# EasyEDA Pro project ProProject_circuller_2023-11-15.epro

# Schematic Schematic1
Create Date: 2023-10-07; Page Name: P1; Project Name: circuller; Schematic Name: Schematic1; Update Date: 2023-10-11; Company: MPAM Lab; Page Size: A3; Version: 0.1
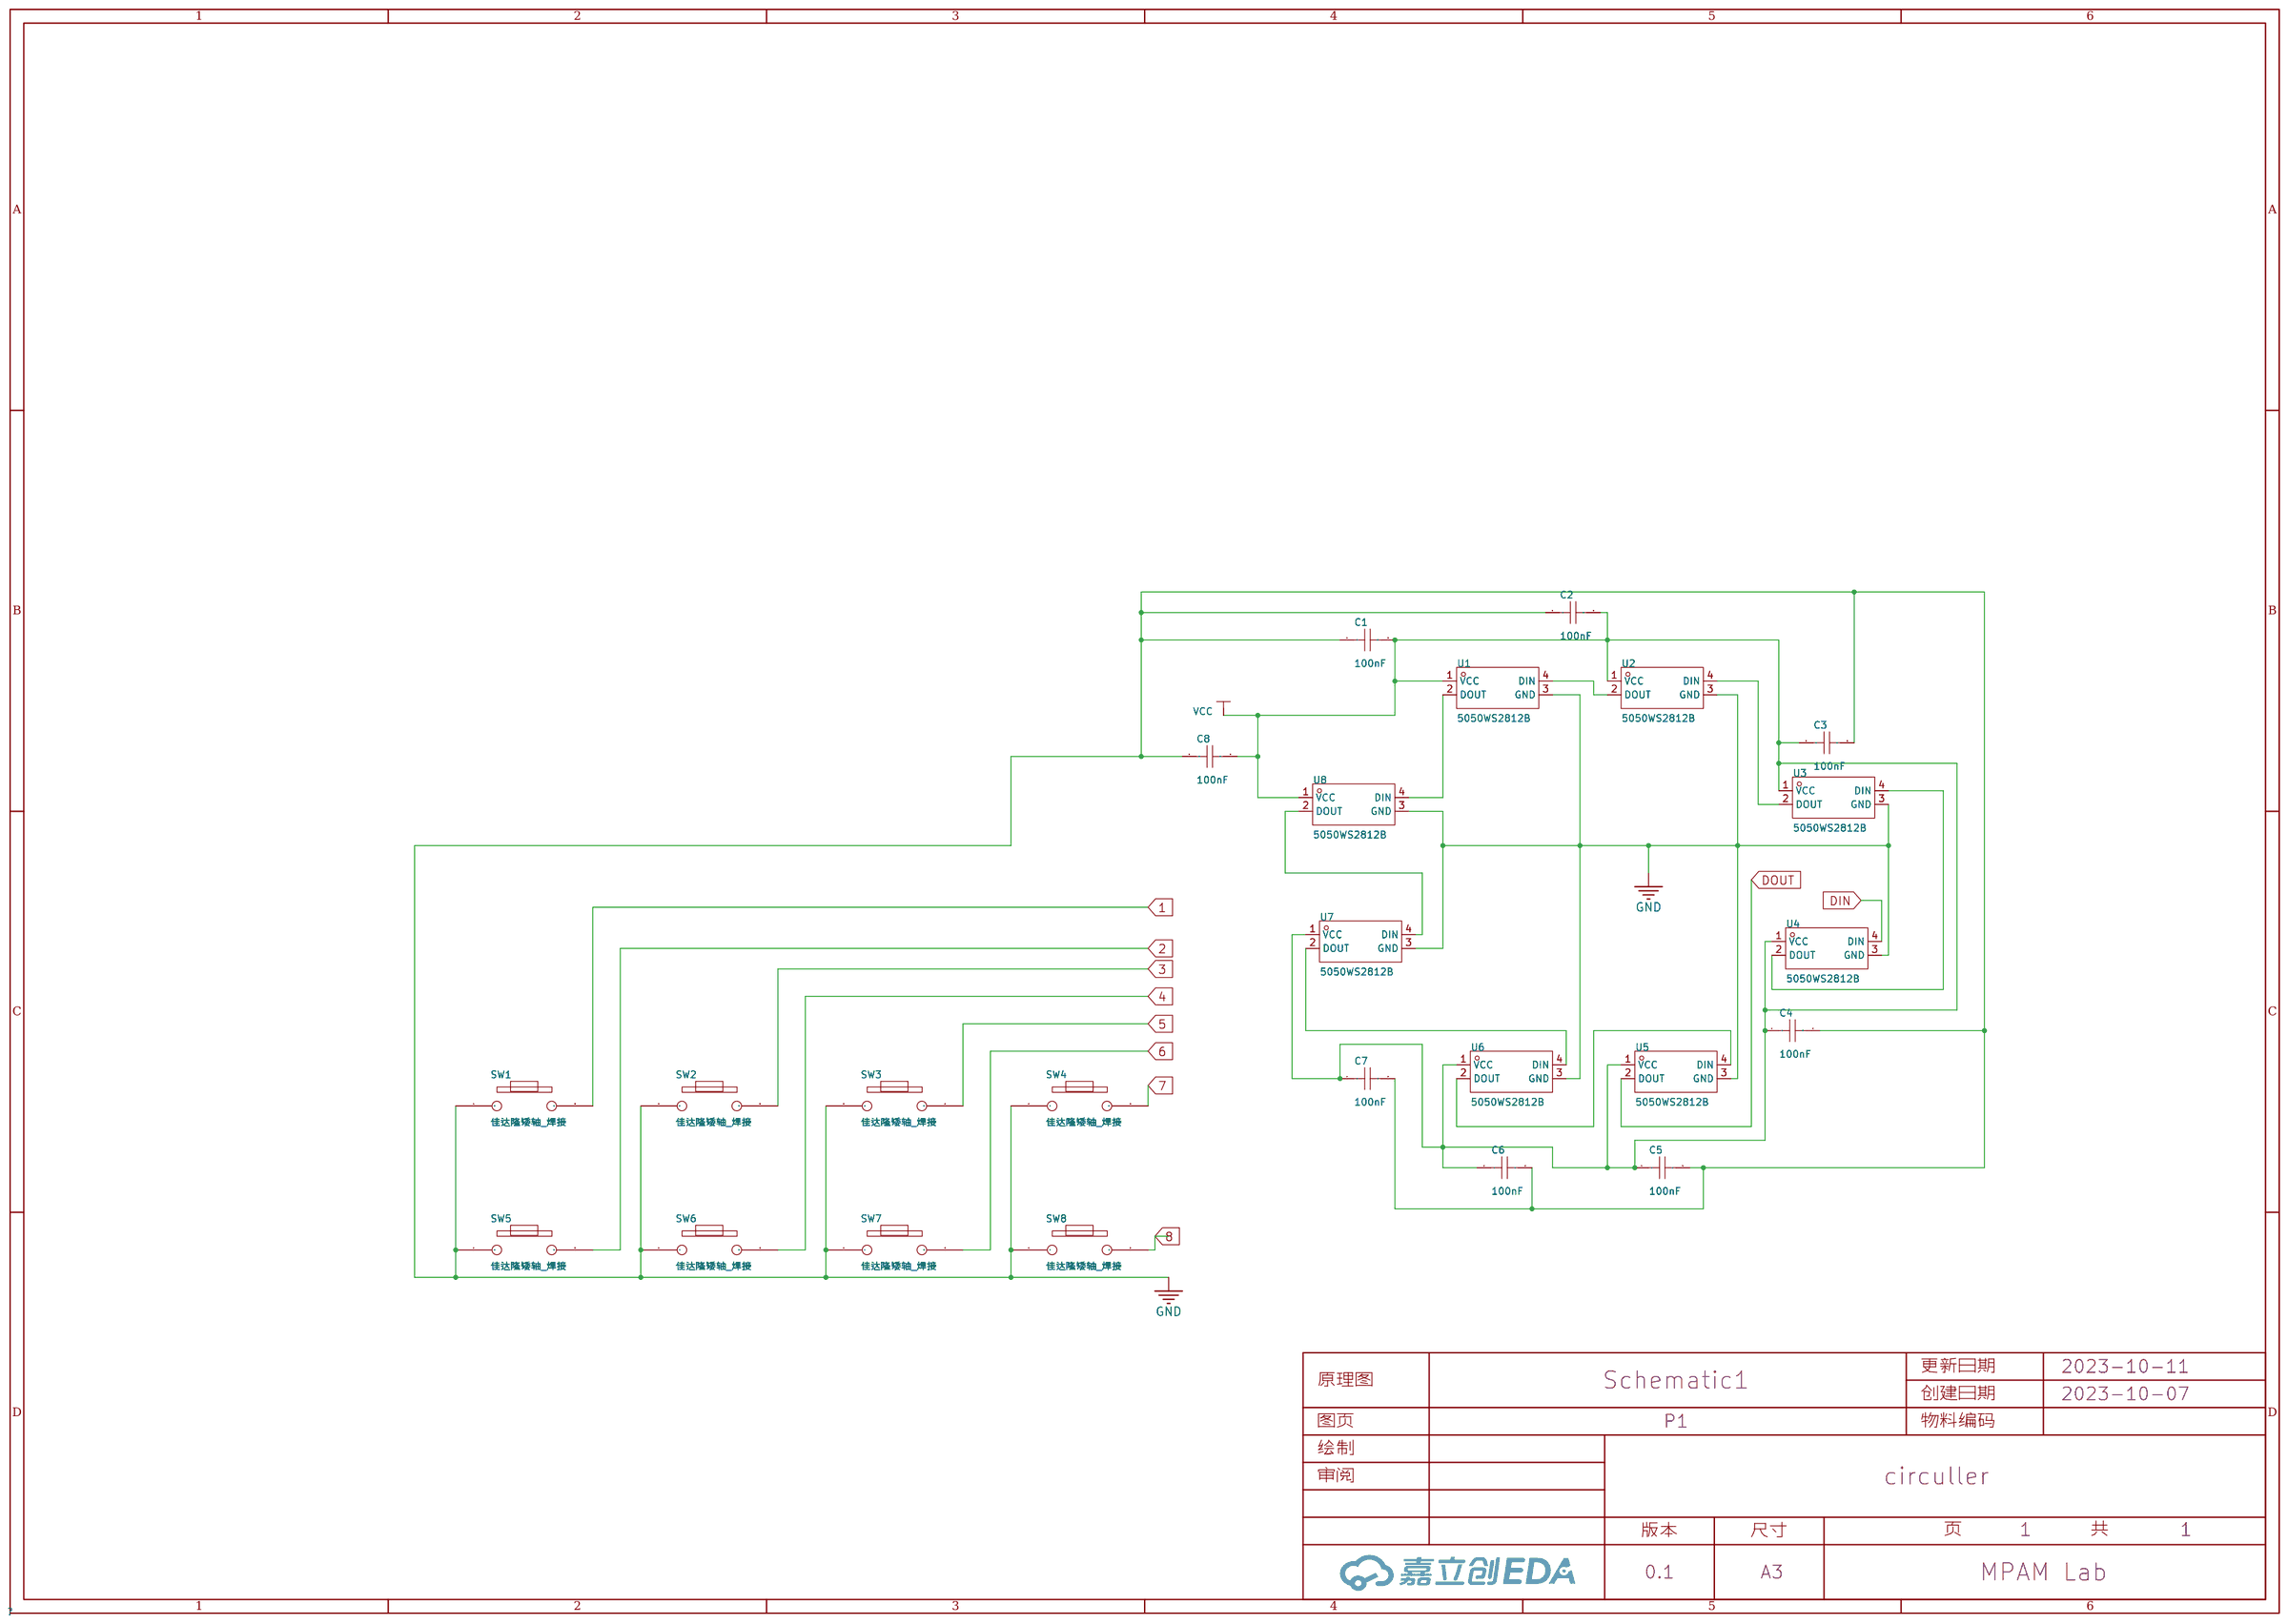
[diagram p0: schematic sheet]

## Parts
C1  100nF  [C0603]
C2  100nF  [C0603]
C3  100nF  [C0603]
C4  100nF  [C0603]
C5  100nF  [C0603]
C6  100nF  [C0603]
C7  100nF  [C0603]
C8  100nF  [C0603]
SW1  佳达隆矮轴_焊接  [佳达隆矮轴焊接]
SW2  佳达隆矮轴_焊接  [佳达隆矮轴焊接]
SW3  佳达隆矮轴_焊接  [佳达隆矮轴焊接]
SW4  佳达隆矮轴_焊接  [佳达隆矮轴焊接]
SW5  佳达隆矮轴_焊接  [佳达隆矮轴焊接]
SW6  佳达隆矮轴_焊接  [佳达隆矮轴焊接]
SW7  佳达隆矮轴_焊接  [佳达隆矮轴焊接]
SW8  佳达隆矮轴_焊接  [佳达隆矮轴焊接]
U1  5050WS2812B  [LED-SMD_5050WS2812B]
U2  5050WS2812B  [LED-SMD_5050WS2812B]
U3  5050WS2812B  [LED-SMD_5050WS2812B]
U4  5050WS2812B  [LED-SMD_5050WS2812B]
U5  5050WS2812B  [LED-SMD_5050WS2812B]
U6  5050WS2812B  [LED-SMD_5050WS2812B]
U7  5050WS2812B  [LED-SMD_5050WS2812B]
U8  5050WS2812B  [LED-SMD_5050WS2812B]

## Library data of the parts
C1-C8 = CAP_0603: Supplier Footprint: 0603
SW1-SW8 = 佳达隆矮轴_焊接: Supplier: eyy
U1-U8 = 5050WS2812B: Supplier Part: C2874876; Supplier Footprint: LED-SMD-4_L5.0-W5.0-P3.20-LS5.4; JLCPCB Part Class: 扩展库; Datasheet: 2021-08-01/763763S/fc73e402754744b5b9326c8825dec5cc/ws2812B.pdf; Supplier: LCSC

## Nets
GND: C1.1 C2.1 C3.2 C4.2 C5.2 C6.2 C7.2 C8.1 SW1.1 SW2.1 SW3.1 SW4.1 SW5.1 SW6.1 SW7.1 SW8.1 U1.3(GND) U2.3(GND) U3.3(GND) U4.3(GND) U5.3(GND) U6.3(GND) U7.3(GND) U8.3(GND)
VCC: C1.2 C2.2 C3.1 C4.1 C5.1 C6.1 C7.1 C8.2 U1.1(VCC) U2.1(VCC) U3.1(VCC) U4.1(VCC) U5.1(VCC) U6.1(VCC) U7.1(VCC) U8.1(VCC)
1: SW1.2
2: SW5.2
3: SW2.2
4: SW6.2
5: SW3.2
6: SW7.2
7: SW4.2
8: SW8.2
DIN: U4.4(DIN)
DOUT: U5.2(DOUT)
$1N1699: U1.2(DOUT) U8.4(DIN)
$1N1729: U1.4(DIN) U2.2(DOUT)
$1N1734: U2.4(DIN) U3.2(DOUT)
$1N1800: U3.4(DIN) U4.2(DOUT)
$1N1842: U6.4(DIN) U7.2(DOUT)
$1N1852: U5.4(DIN) U6.2(DOUT)
$1N6884: U7.4(DIN) U8.2(DOUT)

# Schematic Ver 2
Create Date: 2023-11-13; Page Name: P1; Project Name: circuller; Schematic Name: Ver 2; Update Date: 2023-11-15; Company: MPAM Laboratory; Drawed: FDS; Page Size: A4; Part Number: M-CIR-PCB-1; Reviewed: FDS; Version: V1.0
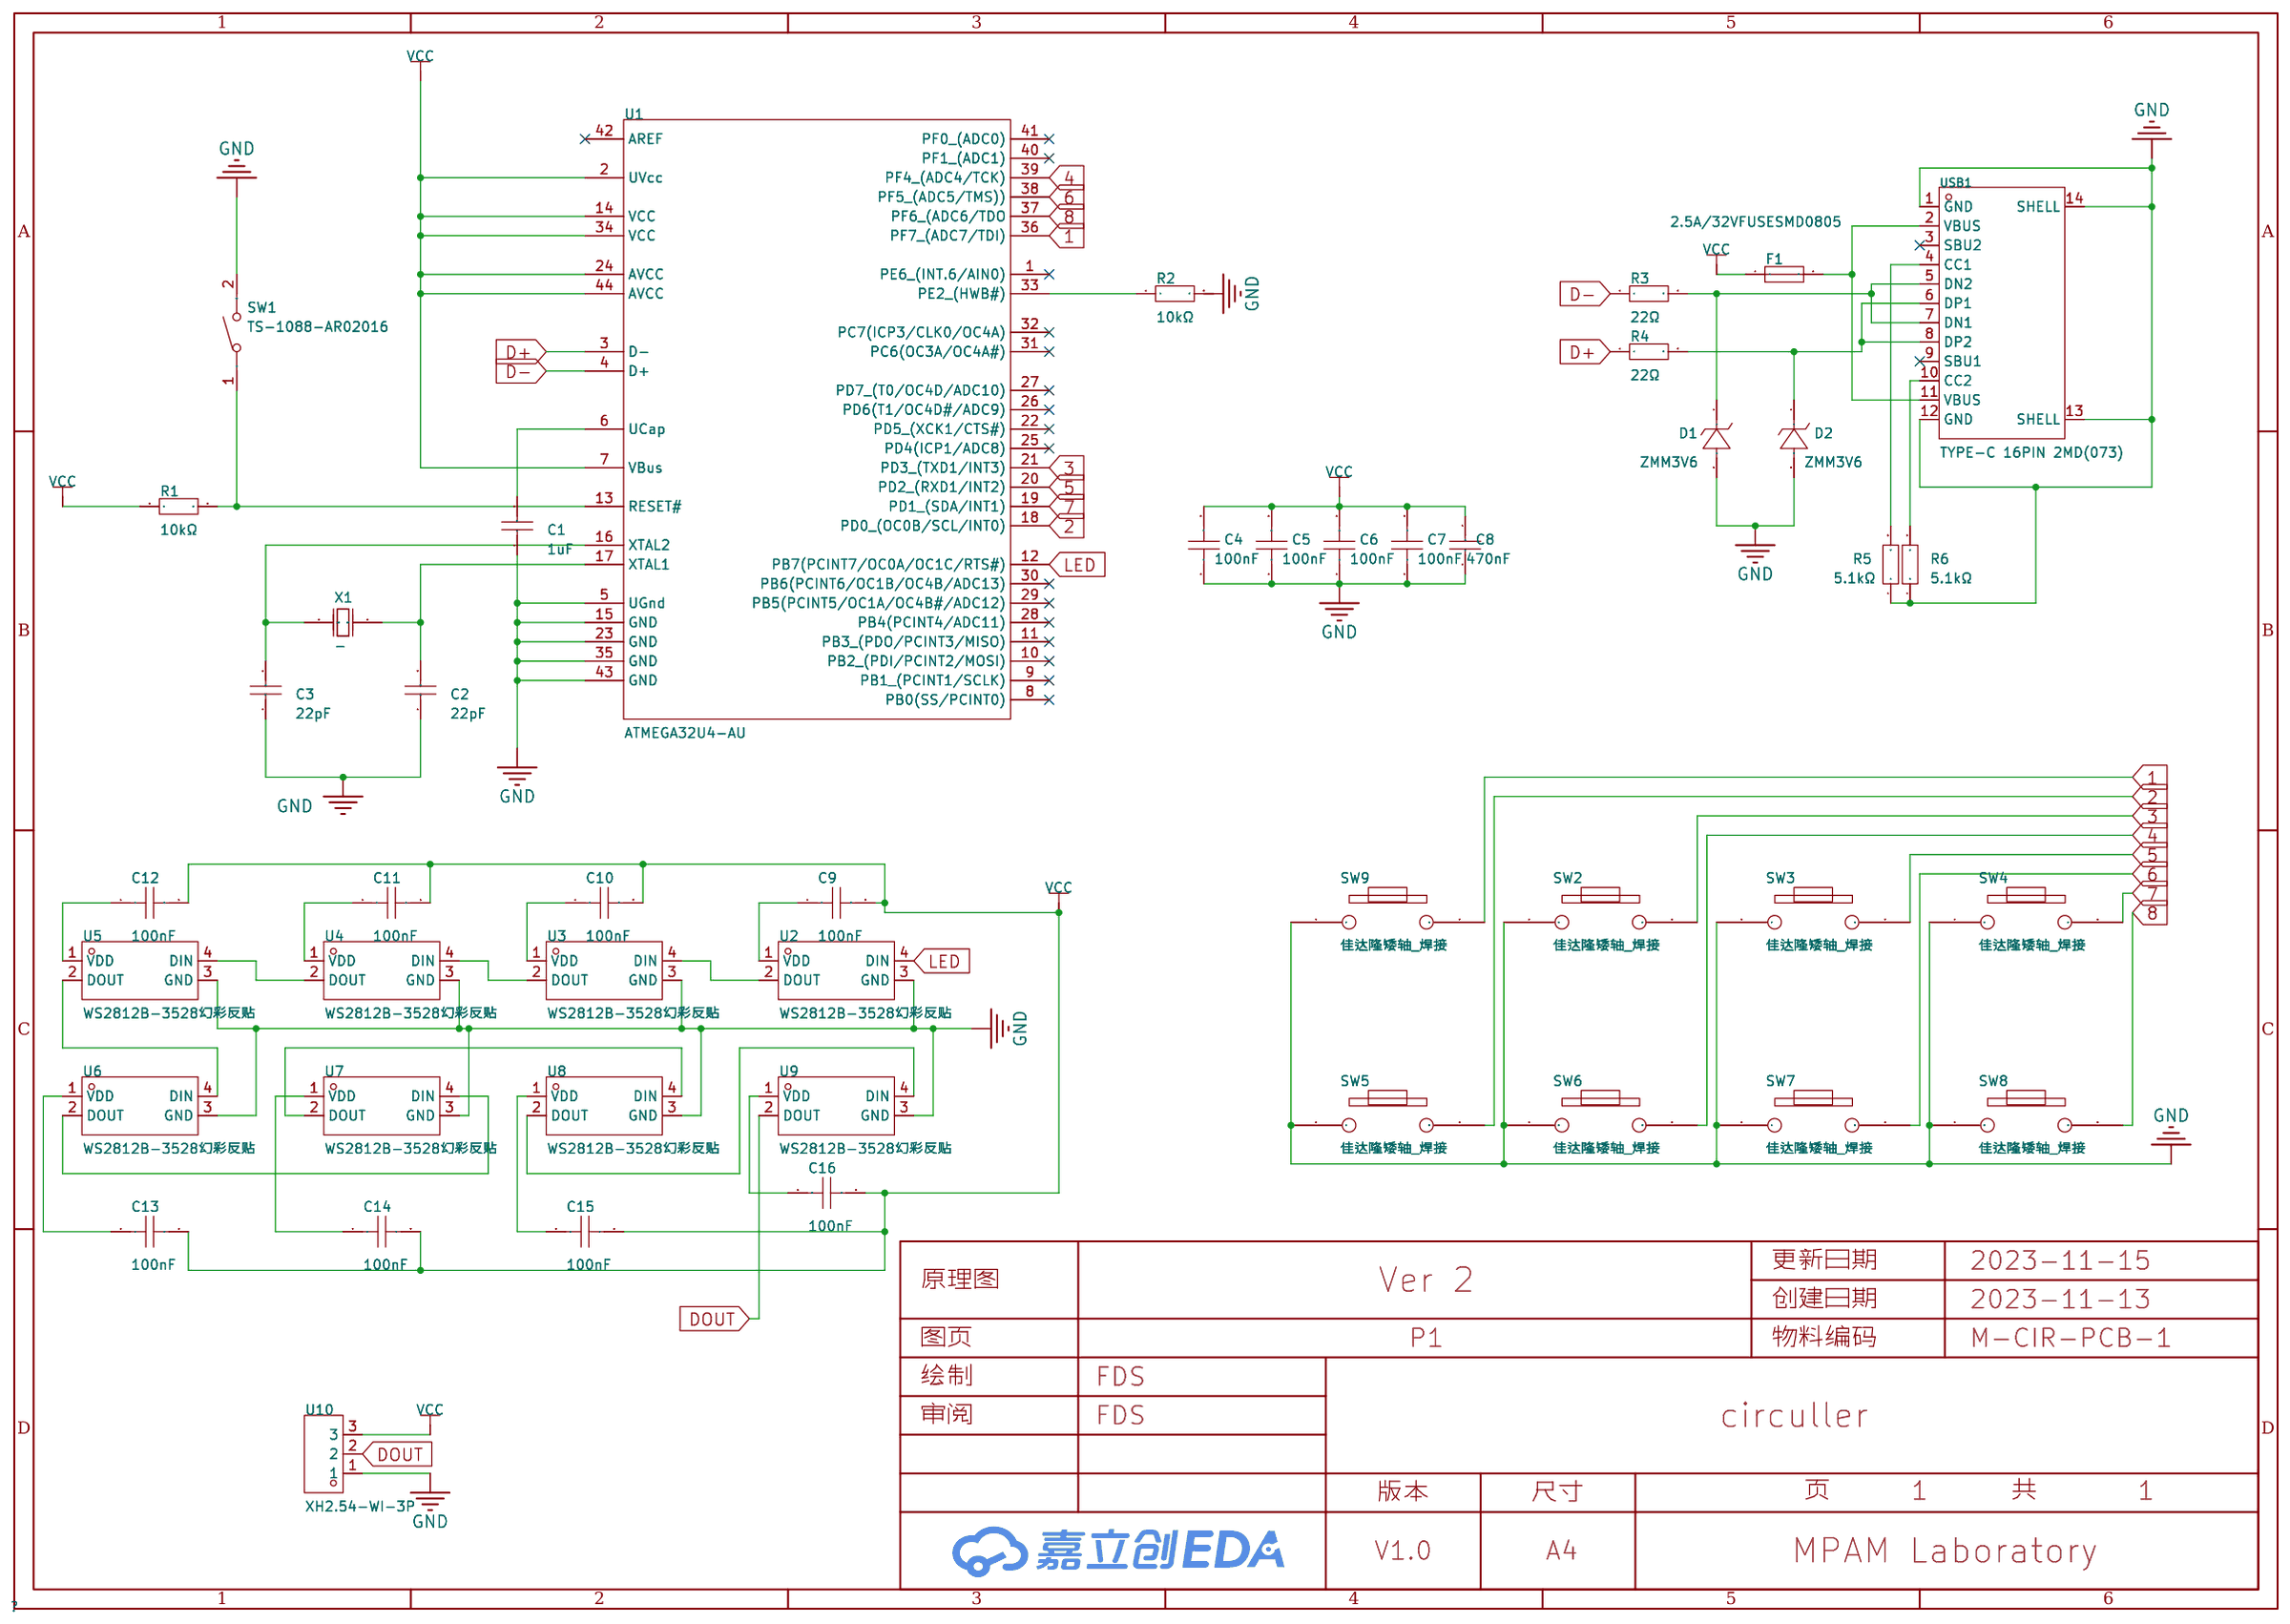
[diagram p1: schematic sheet]

## Parts
C1  1uF  [C0603]
C2  22pF  [C0603]
C3  22pF  [C0603]
C4  100nF  [C0603]
C5  100nF  [C0603]
C6  100nF  [C0603]
C7  100nF  [C0603]
C8  470nF  [C0603]
C9  100nF  [C0603]
C10  100nF  [C0603]
C11  100nF  [C0603]
C12  100nF  [C0603]
C13  100nF  [C0603]
C14  100nF  [C0603]
C15  100nF  [C0603]
C16  100nF  [C0603]
D1  ZMM3V6  [LL-34_L3.5-W1.5-RD]
D2  ZMM3V6  [LL-34_L3.5-W1.5-RD]
F1  2.5A/32VFUSESMD0805  [F0805]
R1  10kΩ  [R0603]
R2  10kΩ  [R0603]
R3  22Ω  [R0603]
R4  22Ω  [R0603]
R5  5.1kΩ  [R0603]
R6  5.1kΩ  [R0603]
SW1  TS-1088-AR02016  [SW-SMD_L3.9-W3.0-P4.45]
SW2  佳达隆矮轴_焊接  [佳达隆矮轴焊接]
SW3  佳达隆矮轴_焊接  [佳达隆矮轴焊接]
SW4  佳达隆矮轴_焊接  [佳达隆矮轴焊接]
SW5  佳达隆矮轴_焊接  [佳达隆矮轴焊接]
SW6  佳达隆矮轴_焊接  [佳达隆矮轴焊接]
SW7  佳达隆矮轴_焊接  [佳达隆矮轴焊接]
SW8  佳达隆矮轴_焊接  [佳达隆矮轴焊接]
SW9  佳达隆矮轴_焊接  [佳达隆矮轴焊接]
U1  ATMEGA32U4-AU  [QFP-44_L10.0-W10.0-P0.80-LS13.2-BL]
U2  WS2812B-3528幻彩反贴  [LED-SMD_L3.2-W2.8-TR]
U3  WS2812B-3528幻彩反贴  [LED-SMD_L3.2-W2.8-TR]
U4  WS2812B-3528幻彩反贴  [LED-SMD_L3.2-W2.8-TR]
U5  WS2812B-3528幻彩反贴  [LED-SMD_L3.2-W2.8-TR]
U6  WS2812B-3528幻彩反贴  [LED-SMD_L3.2-W2.8-TR]
U7  WS2812B-3528幻彩反贴  [LED-SMD_L3.2-W2.8-TR]
U8  WS2812B-3528幻彩反贴  [LED-SMD_L3.2-W2.8-TR]
U9  WS2812B-3528幻彩反贴  [LED-SMD_L3.2-W2.8-TR]
U10  XH2.54-WI-3P  [CONN-TH_XH2.54-WI-3P]
USB1  TYPE-C 16PIN 2MD(073)  [USB-C-SMD_TYPE-C-6PIN-2MD-073]
X1  -  [OSC-SMD_2P-L5.0-W3.2]

## Library data of the parts
C1 = CL10A105KB8NNNC: 容值:1uF;精度:±10%;额定电压:50V;材质(温度系数):X5R;; LCSC Part Name: 1uF ±10% 50V; Supplier Part: C15849; Manufacturer: SAMSUNG(三星); Supplier Footprint: 0603; JLCPCB Part Class: 基础库; Datasheet: https://atta.szlcsc.com/upload/public/pdf/source/20160103/1457707679084.pdf; Supplier: LCSC; Tolerance: ±10%; Voltage Rated: 50V; Temperature Coefficient: X5R
C2 C3 = CL10C220JB8NNNC: 容值:22pF;精度:±5%;额定电压:50V;材质(温度系数):C0G;; LCSC Part Name: 22pF ±5% 50V; Supplier Part: C1653; Manufacturer: SAMSUNG(三星); Supplier Footprint: 0603; JLCPCB Part Class: 基础库; Datasheet: https://atta.szlcsc.com/upload/public/pdf/source/20160218/1457707763339.pdf; Supplier: LCSC; Tolerance: ±5%; Voltage Rated: 50V; Temperature Coefficient: C0G
C4-C7 = CC0603KRX7R9BB104: 容值:100nF;精度:±10%;额定电压:50V;材质(温度系数):X7R;; LCSC Part Name: 100nF ±10% 50V; Supplier Part: C14663; Manufacturer: YAGEO(国巨); Supplier Footprint: 0603; JLCPCB Part Class: 基础库; Datasheet: https://atta.szlcsc.com/upload/public/pdf/source/20180910/C282072_33301C7F631E79921B82A8DAC6BCC5B3.pdf; Supplier: LCSC; Tolerance: ±10%; Voltage Rated: 50V; Temperature Coefficient: X7R
C8 = CL10B474KA8NNNC: 容值:470nF;精度:±10%;额定电压:25V;材质(温度系数):X7R;; LCSC Part Name: 470nF ±10% 25V; Supplier Part: C1623; Manufacturer: SAMSUNG(三星); Supplier Footprint: 0603; JLCPCB Part Class: 基础库; Datasheet: https://atta.szlcsc.com/upload/public/pdf/source/20160218/1457707763339.pdf; Supplier: LCSC; Tolerance: ±10%; Voltage Rated: 25V; Temperature Coefficient: X7R
C9-C16 = CC0603KRX7R9BB104: 容值:100nF;精度:±10%;额定电压:50V;材质(温度系数):X7R;; LCSC Part Name: 100nF ±10% 50V; Supplier Part: C14663; Manufacturer: YAGEO(国巨); Supplier Footprint: 0603; JLCPCB Part Class: Basic Part; Datasheet: https://atta.szlcsc.com/upload/public/pdf/source/20180910/C282072_33301C7F631E79921B82A8DAC6BCC5B3.pdf; Supplier: LCSC; Tolerance: ±10%; Voltage Rated: 50V; Temperature Coefficient: X7R; Check: true
D1 D2 = ZMM3V6: 稳压值(标称值):-;精度:-;功率:500mW;反向电流(Ir):2uA@1V;; LCSC Part Name: 500mW; Supplier Part: C707190; Manufacturer: Slkor(萨科微); Supplier Footprint: LL-34; JLCPCB Part Class: 扩展库; Datasheet: https://atta.szlcsc.com/upload/public/pdf/source/20200721/C707184_776B95022AAA01ECB528B9CFDAFDB27C.pdf; Supplier: LCSC; Power Dissipation: 500mW; Reverse Leakage Current (Ir): 2uA@1V
F1 = 2.5A/32VFUSESMD0805: Supplier Part: C9900004266; JLCPCB Part Class: 扩展库; Datasheet: https://atta.szlcsc.comnull; Supplier: LCSC
R1 R2 = 0603WAF1002T5E: 电阻类型:厚膜电阻;阻值:10kΩ;精度:±1%;功率:100mW;; LCSC Part Name: 厚膜电阻 10kΩ ±1% 100mW; Supplier Part: C25804; Manufacturer: UNI-ROYAL(厚声); Supplier Footprint: 0603; JLCPCB Part Class: 基础库; Datasheet: https://atta.szlcsc.com/upload/public/pdf/source/20200306/C422600_1E6D84923E4A46A82E41ADD87F860B5C.pdf; Supplier: LCSC; Type: 厚膜电阻; Tolerance: ±1%; Power(Watts): 100mW; Temperature Coefficient: ±100ppm/℃; Overload Voltage (Max): 75V; Operating Temperature Range: -55℃~+155℃
R3 R4 = 0603WAF220JT5E: 电阻类型:厚膜电阻;阻值:22Ω;精度:±1%;功率:100mW;温度系数:±100ppm/℃;; LCSC Part Name: 厚膜电阻 22Ω ±1% 100mW; Supplier Part: C23345; Manufacturer: UNI-ROYAL(厚声); Supplier Footprint: 0603; JLCPCB Part Class: 基础库; Datasheet: https://atta.szlcsc.com/upload/public/pdf/source/20200306/C422600_1E6D84923E4A46A82E41ADD87F860B5C.pdf; Supplier: LCSC; Type: 厚膜电阻; Tolerance: ±1%; Power(Watts): 100mW; Temperature Coefficient: ±100ppm/℃; Overload Voltage (Max): 75V; Operating Temperature Range: -55℃~+155℃
R5 R6 = 0603WAF5101T5E: 电阻类型:厚膜电阻;阻值:5.1kΩ;精度:±1%;功率:100mW;温度系数:±100ppm/℃;; LCSC Part Name: 厚膜电阻 5.1kΩ ±1% 100mW; Supplier Part: C23186; Manufacturer: UNI-ROYAL(厚声); Supplier Footprint: 0603; JLCPCB Part Class: 基础库; Datasheet: https://atta.szlcsc.com/upload/public/pdf/source/20200306/C422600_1E6D84923E4A46A82E41ADD87F860B5C.pdf; Supplier: LCSC; Type: 厚膜电阻; Tolerance: ±1%; Power(Watts): 100mW; Temperature Coefficient: ±100ppm/℃; Overload Voltage (Max): 75V; Operating Temperature Range: -55℃~+155℃
SW1 = TS-1088-AR02016: 触点电流:50mA;额定电压(DC):12V;绝缘电阻:100MΩ;电路结构:单刀单掷;安装方式:立贴;作用力:160gf@±50gf;机械寿命:10万次;带支架:否;; LCSC Part Name: 4*3*2mm 立贴 轻触开关; Supplier Part: C720477; Manufacturer: XUNPU(讯普); Supplier Footprint: SMD; JLCPCB Part Class: 扩展库; Datasheet: https://atta.szlcsc.com/upload/public/pdf/source/20200810/C720475_60D09DD6C54279ADDB2DC25100F1CC11.pdf; Supplier: LCSC; Contact Current: 50mA; Voltage Rating (DC): 12V; Insulation Resistance: 100MΩ; Circuit: 单刀单掷; Mounting Style: 立贴; Actuator Style: 圆形按钮; Actuator/Cap Color: 黑色; Operating Force: 160gf@±50gf; Mechanical Life: 10万次; Operating Temperature: -30℃~+80℃; Pin Style: SMD接片; Switch Length: 4mm; Switch Width: 3mm; Switch Height: 2mm; Strike Gundam: 否
SW2-SW9 = 佳达隆矮轴_焊接: Supplier: eyy
U1 = ATMEGA32U4-AU: CPU内核:AVR;CPU最大主频:16MHz;工作电压范围:2.7V~5.5V;程序存储容量:32KB;程序存储器类型:FLASH;RAM总容量:2.5KB;GPIO端口数量:26;; Supplier Part: C44854; Manufacturer: MICROCHIP(美国微芯); Supplier Footprint: QFP-44(10x10); JLCPCB Part Class: 扩展库; Datasheet: https://atta.szlcsc.com/upload/public/pdf/source/20150407/1457707275091.pdf; Supplier: LCSC; CPU Core: AVR; CPU Maximum Speed: 16MHz; Operating Voltage Range: 2.7V~5.5V; Program Storage Size: 32KB; Program Memory Type: FLASH; RAM Size: 2.5KB; EEPROM: 1KB; GPIO Ports Number: 26; ADC (Bit): 10bit; Universal Serial Bus: 有; Peripheral/Function: 看门狗；PWM; Watchdog: 有; Low-Voltage Detect: 有; Internal Oscillator: 有; Operating Temperature Range: -40℃~+85℃
U2-U9 = WS2812B-3528幻彩反贴: Supplier Part: C9900004451; Supplier Footprint: LED-SMD; JLCPCB Part Class: 扩展库; Datasheet: 2021-12-21/757506A/9376501e0a854f2f817213720825c541/WS2812B-3528幻彩反贴.pdf; Supplier: LCSC
U10 = XH2.54-WI-3P: Supplier Part: C9900005531; Supplier Footprint: XH2.54MM-3P; JLCPCB Part Class: 扩展库; Supplier: LCSC
USB1 = TYPE-C 16PIN 2MD(073): 连接器类型:Type-C;标准:-;公母:母座;触点数量:16;端口数量:1;安装方式:卧贴;额定电流 - 电源:5A;工作温度范围:-25℃~+85℃;; LCSC Part Name: TYPE-C母座 16P 4脚插件带定位柱 不锈钢外壳 2次模顶; Supplier Part: C2765186; Manufacturer: SHOU HAN(首韩); Supplier Footprint: SMD; JLCPCB Part Class: 扩展库; Supplier: LCSC; Connector Type: Type-C; Gender: 母座; Number of Contacts: 16; Number of Ports: 1; Mounting Style: 卧贴; Current Rating - Power (Max): 5A; Operating Temperature Range: -25℃~+85℃
X1 = XSHEELNANF-16MHZ: 频率:-;负载电容:-;; LCSC Part Name: 16MHz 20pF ±30PPM -40℃ ~+85℃; Supplier Part: C242221; Manufacturer: TAITIEN(泰艺电子); Supplier Footprint: SMD5032-2P; JLCPCB Part Class: 扩展库; Datasheet: https://atta.szlcsc.com/upload/public/pdf/source/20180704/C242221_71476AA24F58019514D39B5873D4BE18.pdf; Supplier: LCSC

## Nets
GND: C1.1 C2.1 C3.1 C4.1 C5.1 C6.1 C7.1 C8.1 D1.2(A) D2.2(A) R2.2 R5.1 R6.1 SW1.2 SW2.1 SW3.1 SW4.1 SW5.1 SW6.1 SW7.1 SW8.1 SW9.1 U1.5(UGnd) U1.15(GND) U1.23(GND) U1.35(GND) U1.43(GND) U2.3(GND) U3.3(GND) U4.3(GND) U5.3(GND) U6.3(GND) U7.3(GND) U8.3(GND) U9.3(GND) U10.1 USB1.1(GND) USB1.12(GND) USB1.13(SHELL) USB1.14(SHELL)
VCC: C4.2 C5.2 C6.2 C7.2 C8.2 C9.2 C10.2 C11.2 C12.2 C13.2 C14.2 C15.2 C16.2 F1.1 R1.1 U1.2(UVcc) U1.7(VBus) U1.14(VCC) U1.24(AVCC) U1.34(VCC) U1.44(AVCC) U10.3
1: SW9.2 U1.36(PF7 (ADC7/TDI))
2: SW5.2 U1.18(PD0 (OC0B/SCL/INT0))
3: SW2.2 U1.21(PD3 (TXD1/INT3))
4: SW6.2 U1.39(PF4 (ADC4/TCK))
5: SW3.2 U1.20(PD2 (RXD1/INT2))
6: SW7.2 U1.38(PF5 (ADC5/TMS)))
7: SW4.2 U1.19(PD1 (SDA/INT1))
8: SW8.2 U1.37(PF6 (ADC6/TDO)
D+: R4.1 U1.3(D-)
D-: R3.1 U1.4(D+)
DOUT: U9.2(DOUT) U10.2
LED: U1.12(PB7(PCINT7/OC0A/OC1C/RTS#)) U2.4(DIN)
$1N992: C2.2 U1.17(XTAL1) X1.2(OSC2)
$1N1040: C3.2 U1.16(XTAL2) X1.1(OSC1)
$1N1214: R1.2 SW1.1 U1.13(RESET#)
$1N1318: R2.1 U1.33(PE2 (HWB#))
$1N2823: F1.2 USB1.2(VBUS) USB1.11(VBUS)
$1N3423: D1.1(K) R3.2 USB1.5(DN2) USB1.7(DN1)
$1N3438: D2.1(K) R4.2 USB1.6(DP1) USB1.8(DP2)
$1N3472: R5.2 USB1.4(CC1)
$1N3479: R6.2 USB1.10(CC2)
$1N3933: U2.2(DOUT) U3.4(DIN)
$1N3938: U3.2(DOUT) U4.4(DIN)
$1N3943: U4.2(DOUT) U5.4(DIN)
$1N3948: U5.2(DOUT) U6.4(DIN)
$1N3953: U6.2(DOUT) U7.4(DIN)
$1N3959: U7.2(DOUT) U8.4(DIN)
$1N3965: U8.2(DOUT) U9.4(DIN)
$1N4279: C9.1 U2.1(VDD)
$1N4296: C10.1 U3.1(VDD)
$1N4306: C11.1 U4.1(VDD)
$1N4316: C12.1 U5.1(VDD)
$1N4320: C13.1 U6.1(VDD)
$1N4353: C16.1 U9.1(VDD)
$1N4416: C14.1 U7.1(VDD)
$1N4551: C15.1 U8.1(VDD)
$1N4867: C1.2 U1.6(UCap)

Not connected (* = marked no-connect by the designer): U1 1(PE6 (INT.6/AIN0))* 8(PB0(SS/PCINT0))* 9(PB1 (PCINT1/SCLK))* 10(PB2 (PDI/PCINT2/MOSI))* 11(PB3 (PDO/PCINT3/MISO))* 22(PD5 (XCK1/CTS#))* 25(PD4(ICP1/ADC8))* 26(PD6(T1/OC4D#/ADC9))* 27(PD7 (T0/OC4D/ADC10))* 28(PB4(PCINT4/ADC11))* 29(PB5(PCINT5/OC1A/OC4B#/ADC12))* 30(PB6(PCINT6/OC1B/OC4B/ADC13))* 31(PC6(OC3A/OC4A#))* 32(PC7(ICP3/CLK0/OC4A))* 40(PF1 (ADC1))* 41(PF0 (ADC0))* 42(AREF)*; USB1 3(SBU2)* 9(SBU1)*

# Board PCB5
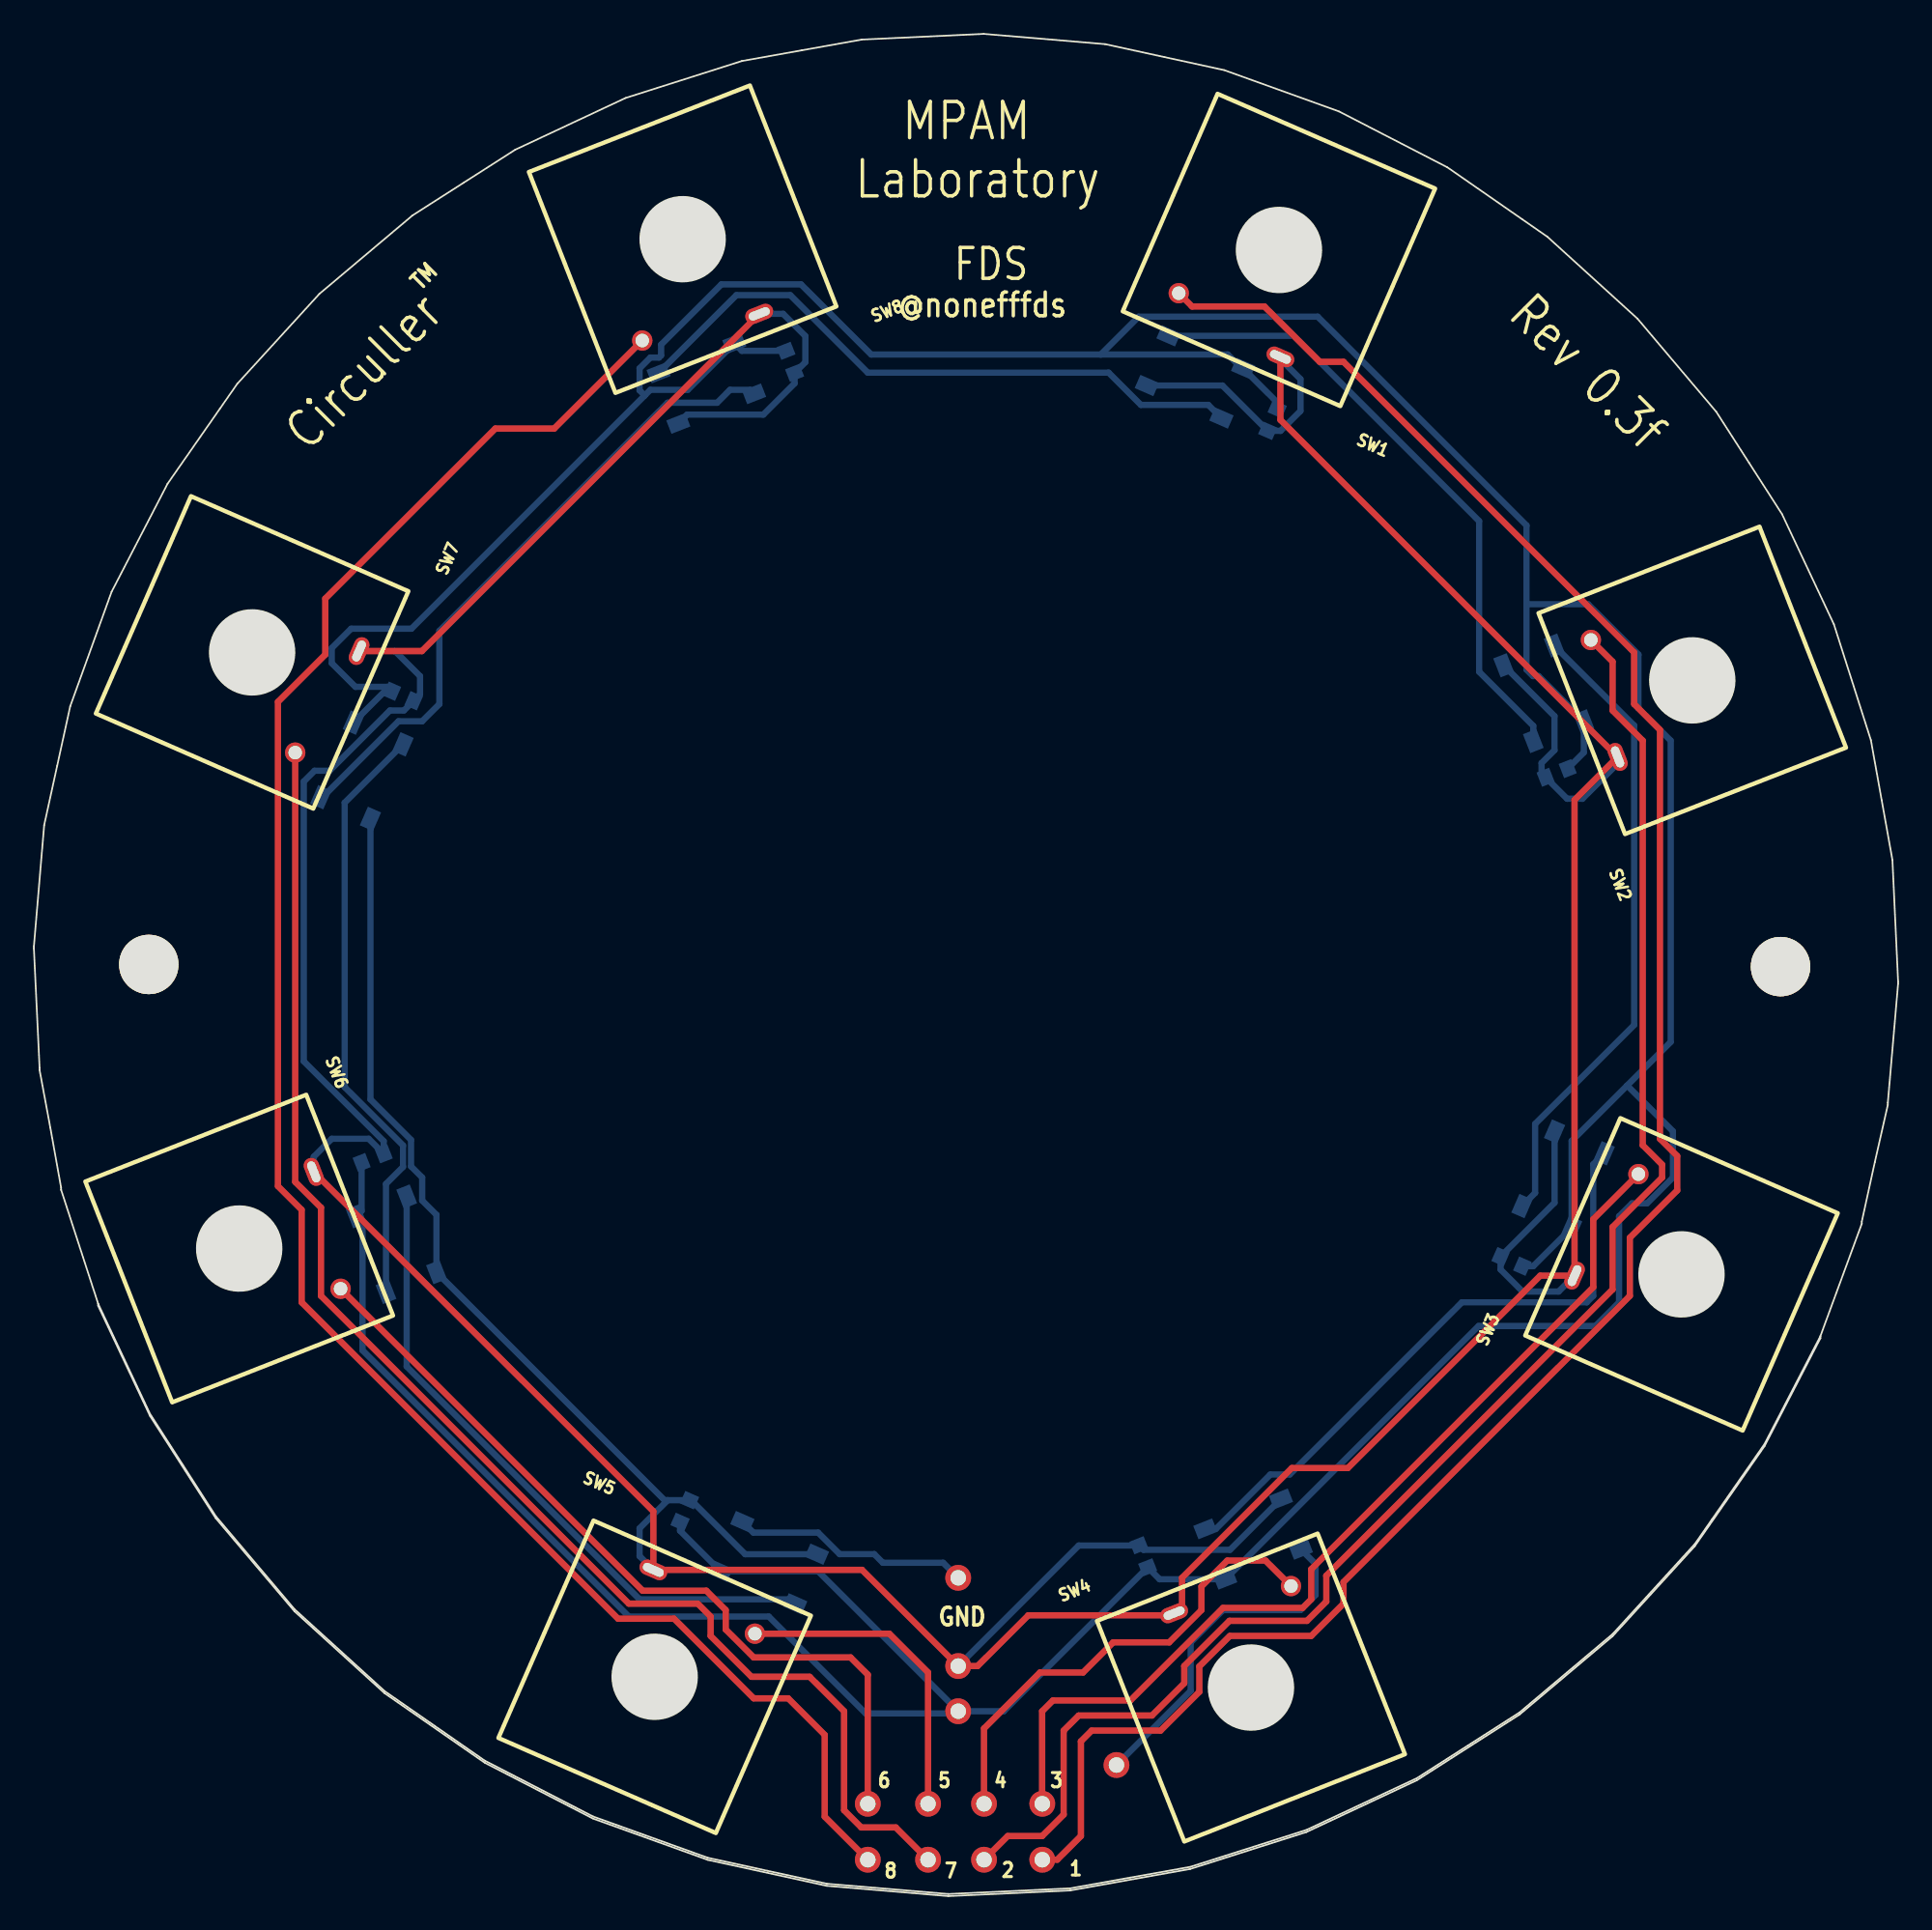
[diagram p2: board, top side]
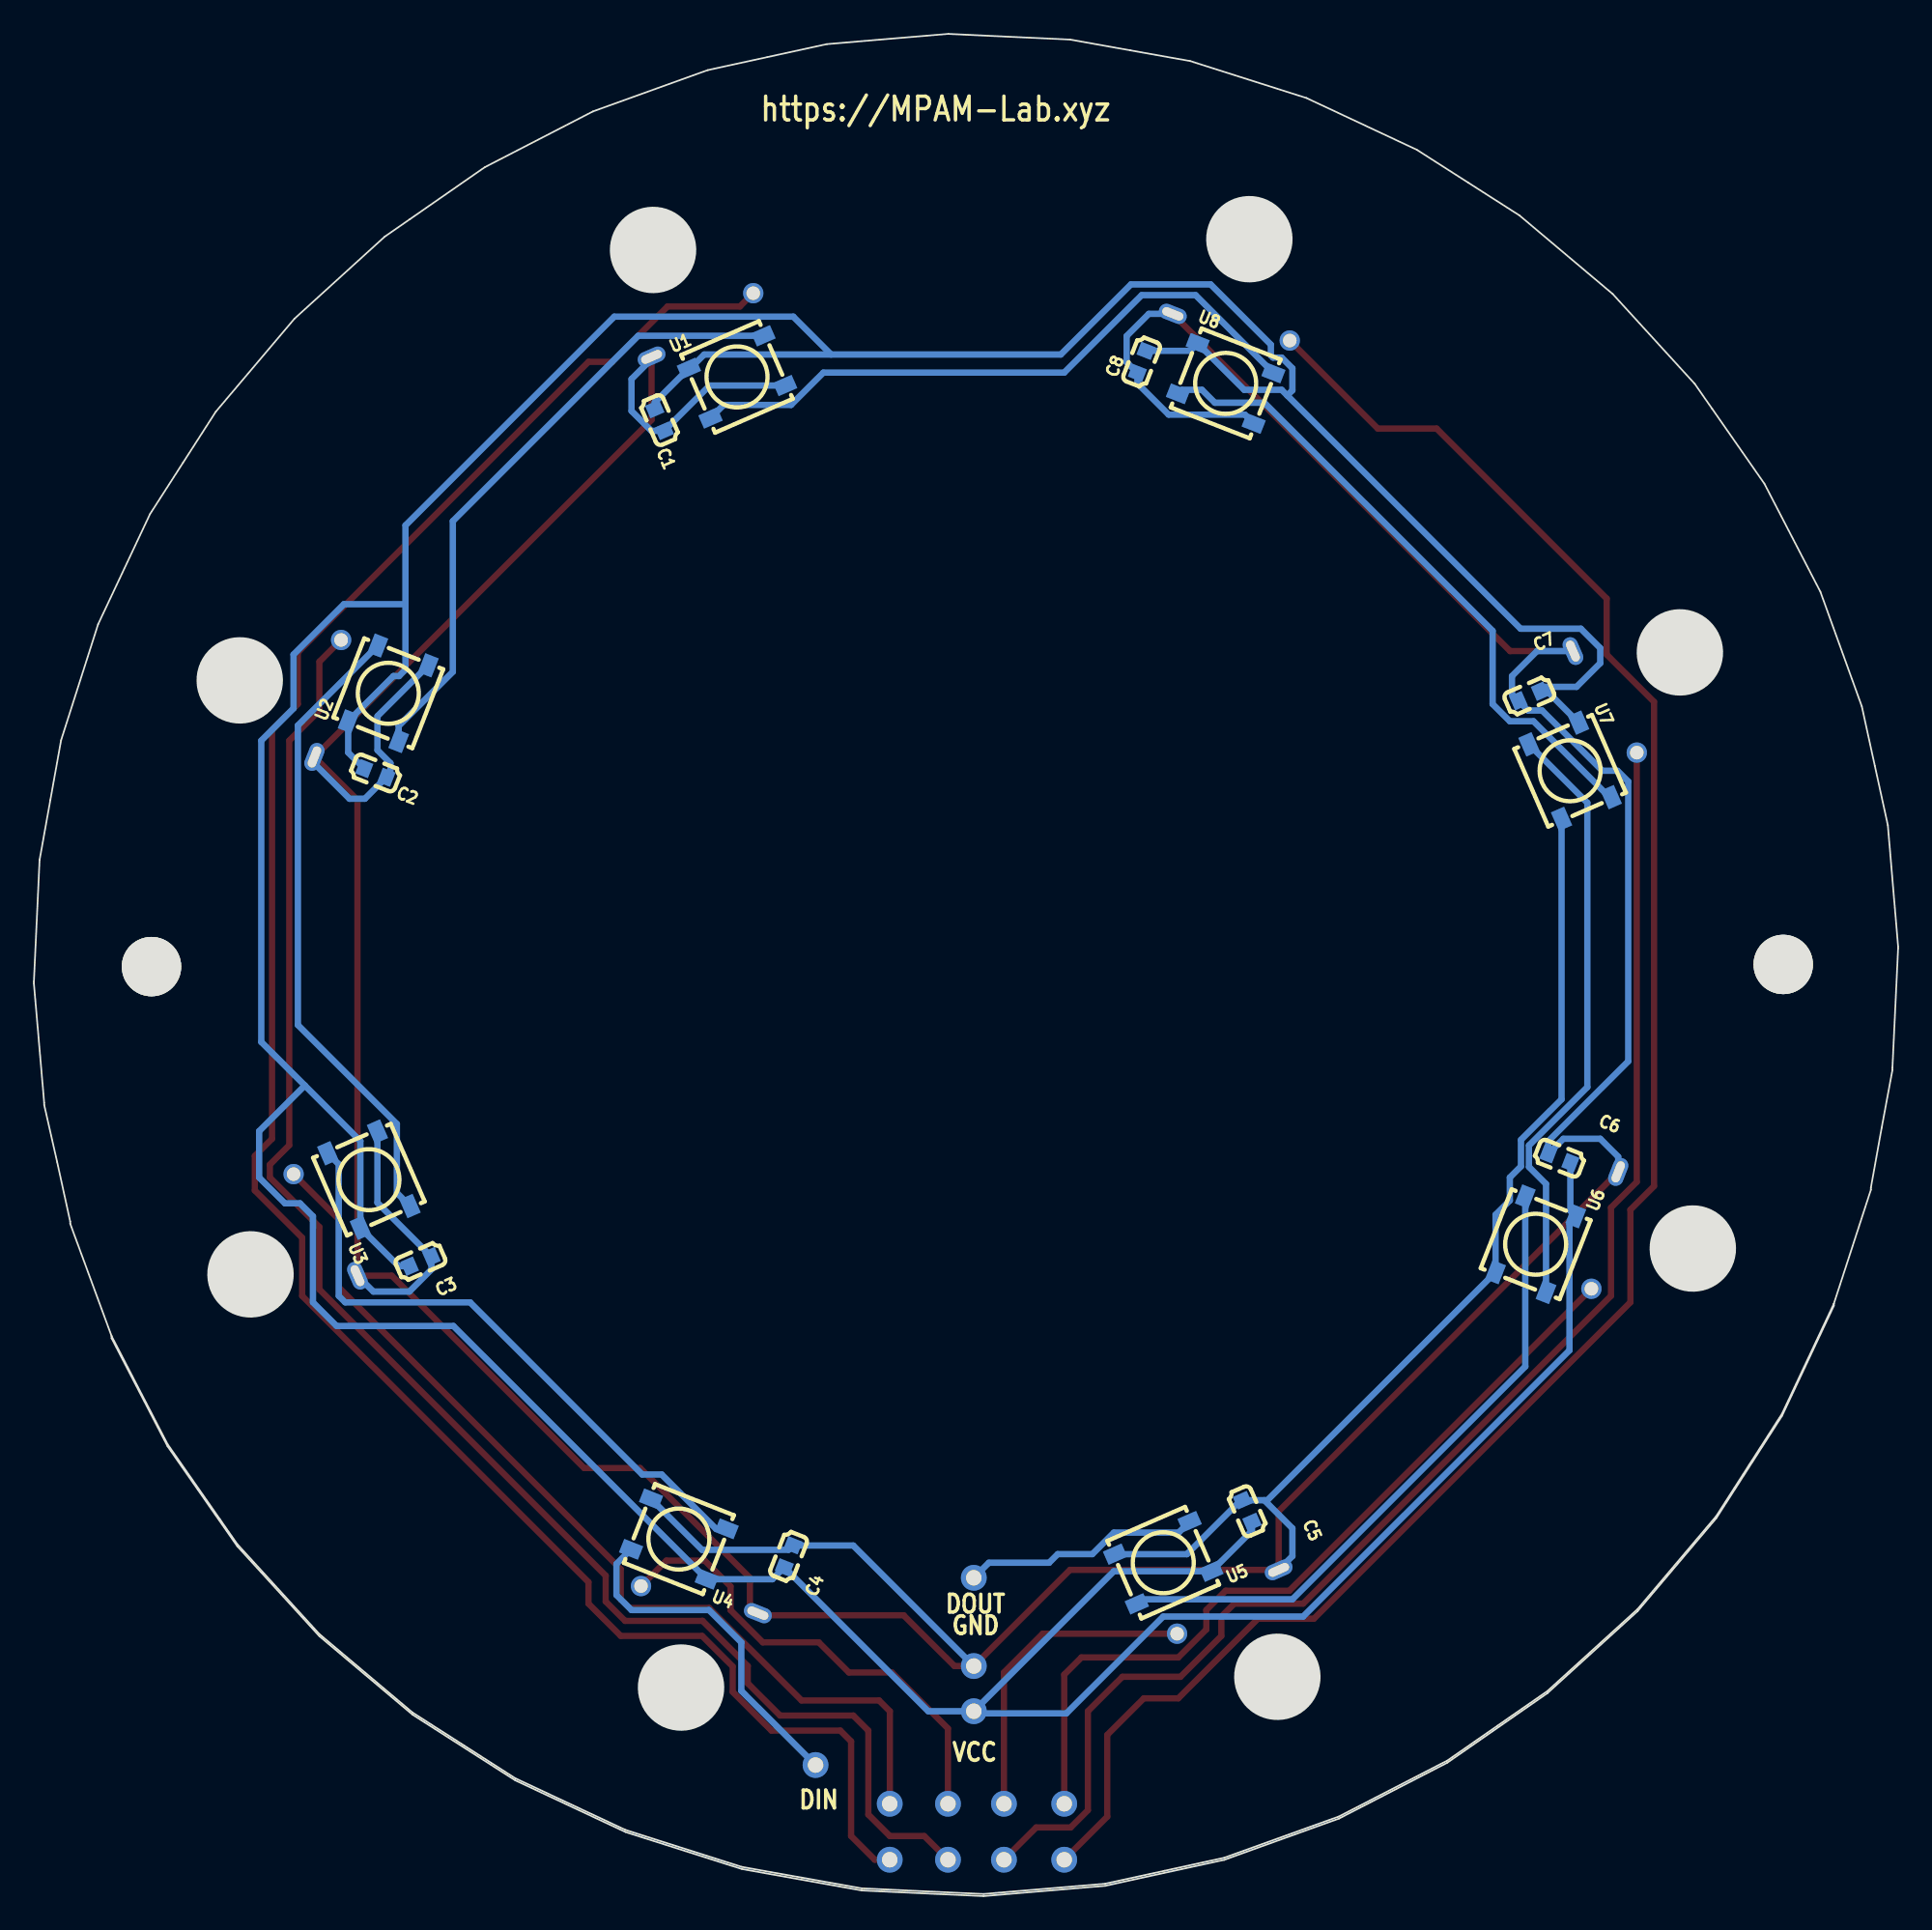
[diagram p3: board, bottom side, seen from below]

Outline 109.98 x 109.89 mm; copper layers: Top Layer, Bottom Layer. Coordinates in mm from the lower left corner of the outline.
Outline path: 3.79,34.96 1.6,41.68 1.6,41.81 0.97,45.34 0.33,48.75 0.33,48.87 0,55.92 0,56.05 0.61,63.2 1.37,66.71 2.14,70.22 4.58,76.97 7.89,83.35 12,89.24 16.84,94.55 22.34,99.18 25.37,101.12 28.39,103.06 34.91,106.11 41.76,108.29 45.3,108.93 48.84,109.56 56.03,109.89 63.2,109.29 66.71,108.52 70.23,107.75 76.99,105.32 83.38,102.02 89.29,97.92 94.61,93.08 99.25,87.6 101.19,84.58 103.13,81.55 106.19,75.05 108.38,68.21 109.01,64.68 109.65,61.14 109.98,53.97 109.98,53.85 109.37,46.82 109.37,46.69 108.61,43.31 107.84,39.8 107.84,39.68 105.4,33.05 ; 3.79,34.96 3.79,34.84 6.85,28.34 10.73,22.3 15.37,16.81 20.69,11.97 26.6,7.87 32.99,4.57 39.75,2.14 46.78,0.61 53.95,0 61.14,0.33 68.22,1.6 75.07,3.78 81.59,6.84 87.64,10.71 93.14,15.34 97.98,20.65 102.09,26.54 105.4,32.92 105.4,33.05 ; 3.79,34.96 6.85,28.46 8.79,25.44 10.73,22.42 15.37,16.93 20.69,12.1 23.64,10.05 26.6,8 32.99,4.7 39.75,2.26 43.27,1.5 46.78,0.73 53.95,0.12 61.14,0.46 64.68,1.09 68.22,1.73 75.07,3.91 81.59,6.96 84.61,8.9 87.64,10.83 93.14,15.47 97.98,20.77 102.09,26.67 105.4,33.05
Stack: Top Layer 0.035mm - / Dielectric1 0.91mm FR4 er 4.5 / Bottom Layer 0.035mm -

## Design rules (mm)
template: JLCPCB Capability(Two Layers Board)
spacing copperThickness1oz (default): track to track 0.102, other pairs 0.152 to 0.3
spacing copperThickness2oz: track to track 0.203, other pairs 0.152 to 0.3
track width copperThickness1oz (default): min 0.127, default 0.254, max 2.54
track width copperThickness2oz: min 0.203, default 0.254, max 2.54
differential pair differentialPair (default): width min 0.127, default 0.254, max 2.54; gap min 0.152, default 0.152
via viaSize (default): diameter min 0.5, default 0.61, max 10; hole min 0.3, default 0.305, max 6.3

## Placement (name value [footprint] x y rotation side)
C1  100nF  [C0603]  73.07 87.11 66.5 bottom
C2  100nF  [C0603]  89.84 66.28 21.4 bottom
C3  100nF  [C0603]  87.17 37.45 156.4 bottom
C4  100nF  [C0603]  65.45 20.05 111.6 bottom
C5  100nF  [C0603]  38.4 22.72 66.4 bottom
C6  100nF  [C0603]  19.99 43.55 21.5 bottom
C7  100nF  [C0603]  21.76 70.82 336.4 bottom
C8  100nF  [C0603]  44.62 90.54 111.4 bottom
NOREF  -  [Pad_e278]  56.05 2.15 0 top
NOREF#2  -  [Pad_e820]  103.04 54.85 0 top
NOREF#3  -  [Pad_e280]  49.2 5.45 0 top
NOREF#4  -  [Pad_e279]  59.49 2.15 0 top
NOREF#5  -  [Pad_e1166]  63.87 7.74 0 top
NOREF#6  -  [Pad_e282]  56.05 5.45 0 top
NOREF#7  -  [Pad_e283]  59.49 5.45 0 top
NOREF#8  -  [Pad_e819]  6.78 54.98 0 top
NOREF#9  -  [Pad_e281]  52.75 5.45 0 top
NOREF#10  -  [Pad_e1124]  54.53 10.91 0 top
NOREF#11  -  [Pad_e284]  54.53 13.58 0 top
NOREF#12  -  [Pad_e277]  52.75 2.15 0 top
NOREF#13  -  [Pad_e276]  49.2 2.15 0 top
NOREF#14  -  [Pad_e1160]  54.53 18.78 0 top
SW1  佳达隆矮轴_焊接  [佳达隆矮轴焊接]  73.45 97.14 156.5 top
SW2  佳达隆矮轴_焊接  [佳达隆矮轴焊接]  97.84 71.74 111.4 top
SW3  佳达隆矮轴_焊接  [佳达隆矮轴焊接]  97.2 36.69 66.4 top
SW4  佳达隆矮轴_焊接  [佳达隆矮轴焊接]  71.8 12.31 21.6 top
SW5  佳达隆矮轴_焊接  [佳达隆矮轴焊接]  36.62 12.94 336.4 top
SW6  佳达隆矮轴_焊接  [佳达隆矮轴焊接]  12.11 38.22 291.5 top
SW7  佳达隆矮轴_焊接  [佳达隆矮轴焊接]  12.87 73.39 246.4 top
SW8  佳达隆矮轴_焊接  [佳达隆矮轴焊接]  38.27 97.78 201.4 top
U1  5050WS2812B  [LED-SMD_5050WS2812B]  68.5 89.65 156.5 bottom
U2  5050WS2812B  [LED-SMD_5050WS2812B]  89.07 70.98 111.4 bottom
U3  5050WS2812B  [LED-SMD_5050WS2812B]  90.22 42.28 66.4 bottom
U4  5050WS2812B  [LED-SMD_5050WS2812B]  71.93 21.07 21.6 bottom
U5  5050WS2812B  [LED-SMD_5050WS2812B]  43.35 19.67 336.4 bottom
U6  5050WS2812B  [LED-SMD_5050WS2812B]  21.38 38.47 291.5 bottom
U7  5050WS2812B  [LED-SMD_5050WS2812B]  19.35 66.41 246.4 bottom
U8  5050WS2812B  [LED-SMD_5050WS2812B]  39.67 89.27 201.4 bottom

## Footprints (pads in the part's own frame, mm; a bottom-side part is the same pattern mirrored in y, then rotated)
C0603
  rect 0.8x0.9 smd: 1(-0.7,0) 2(0.7,0)
LED-SMD_5050WS2812B
  rect 1.2x0.85 smd: 1(-2.4,1.6) 2(-2.4,-1.6) 3(2.4,-1.6) 4(2.4,1.6)
Pad_e276
  round 1.524 hole 0.914: 1(0,0)
Pad_e277
  round 1.524 hole 0.914: 2(0,0)
Pad_e278
  round 1.524 hole 0.914: 3(0,0)
Pad_e279
  round 1.524 hole 0.914: 4(0,0)
Pad_e280
  round 1.524 hole 0.914: 5(0,0)
Pad_e281
  round 1.524 hole 0.914: 6(0,0)
Pad_e282
  round 1.524 hole 0.914: 7(0,0)
Pad_e283
  round 1.524 hole 0.914: 8(0,0)
Pad_e284
  round 1.524 hole 0.914: 9(0,0)
Pad_e819
  round 3.5 hole 3.5: 13(0,0)
Pad_e820
  round 3.5 hole 3.5: 14(0,0)
Pad_e1124
  round 1.524 hole 0.914: 10(0,0)
Pad_e1160
  round 1.524 hole 0.914: 11(0,0)
Pad_e1166
  round 1.524 hole 0.914: 12(0,0)
佳达隆矮轴焊接
  oval 1.7x0.9 hole 1.3x0.5: 1(-2.6,5.75)
  round 1.2 hole 0.8: 2(4.4,4.7)

## Nets
GND: C1.1 C2.1 C3.2 C4.2 C5.2 C6.2 C7.2 C8.1 NOREF#11.9 SW1.1 SW2.1 SW3.1 SW4.1 SW5.1 SW6.1 SW7.1 SW8.1 U1.3 U2.3 U3.3 U4.3 U5.3 U6.3 U7.3 U8.3
VCC: C1.2 C2.2 C3.1 C4.1 C5.1 C6.1 C7.1 C8.2 NOREF#10.10 U1.1 U2.1 U3.1 U4.1 U5.1 U6.1 U7.1 U8.1
1: NOREF#4.4 SW1.2
2: NOREF#9.6 SW5.2
3: NOREF.3 SW2.2
4: NOREF#3.5 SW6.2
5: NOREF#7.8 SW3.2
6: NOREF#12.2 SW7.2
7: NOREF#6.7 SW4.2
8: NOREF#13.1 SW8.2
DIN: NOREF#5.12 U4.4
DOUT: NOREF#14.11 U5.2
$1N1699: U1.2 U8.4
$1N1729: U1.4 U2.2
$1N1734: U2.4 U3.2
$1N1800: U3.4 U4.2
$1N1842: U6.4 U7.2
$1N1852: U5.4 U6.2
$1N6884: U7.4 U8.2

Pads without a net: NOREF#2 14; NOREF#8 13

## Via types
v1: diameter 0.61, hole 0.305, Top Layer to Bottom Layer, 1 via

## Routing (per net, layer and track width the routed paths; a pad name or vN(x,y) marks a point on that pad's centre or on a via; arc(x,y) is an arc through that point)
GND: length 382.3
  Top Layer w0.37: SW7.1 22.89,73.47 SW8.1 ; 73.37,90.67 73.54,90.83 73.54,87.12 SW2.1 90.89,64.69 SW3.1 88.87,36.61 77.52,25.26 74.21,25.26 67.74,18.78 67.74,17.16 SW4.1 67.14,16.57 58.67,16.57 55.67,13.58 v1(54.53,13.58) 48.85,19.25 36.54,19.25 36.54,22.71 SW6.1
  Bottom Layer w0.37: SW3.1 89.95,35.68 87.83,35.68 86.53,36.98 C3.2 89.71,40.92 89.71,45.12 ; 37.39,23.36 C5.2 38.78,23.36 41.96,20.18 46.19,20.18 ; 37.39,23.36 37.21,23.36 U6.3 23.75,40.21 22.91,41.05 22.91,42.41 22.25,43.06 22.25,44.63 19.85,47.02 19.85,63.57 ; 37.39,23.36 35.73,21.71 35.73,20.06 36.54,19.25 ; U1.3 70.12,89.14 C1.1 73.55,86.47 74.72,87.64 74.72,89.52 73.54,90.71 73.54,90.83 ; U2.3 89.71,69.63 89.71,67.62 88.95,66.86 88.95,66.26 90.45,64.76 91.36,64.76 93.43,66.83 SW2.1 ; U8.3 38.54,87.43 43.03,87.43 44.88,89.27 44.88,89.89 ; SW8.1 44.2,93.37 45.51,92.06 45.51,90.52 44.88,89.89 ; SW6.1 16.51,43.63 17.57,44.69 19.75,44.69 20.64,43.81 20.64,44.55 15.92,49.26 15.92,65.77 16.56,66.41 17.45,66.41 21,69.97 21.83,69.97 C7.2 22.78,70.92 22.78,72 21.3,73.47 SW7.1 ; U4.3 70.57,20.44 65.46,20.44 C4.2 65.18,20.69 61.64,20.69 v1(54.53,13.58)
VCC: length 325.9
  Bottom Layer w0.37: C3.1 88.45,37.17 90.72,39.44 90.72,44.56 94,47.84 ; 62.94,90.97 65.18,93.21 75.74,93.21 88.06,80.89 88.06,76.24 ; 62.94,90.97 70.43,90.97 71.25,90.16 U1.1 73.35,88.15 C1.2 ; 62.94,90.97 49.4,90.97 45.26,95.11 40.56,95.11 37,91.56 37,90.92 36.88,90.79 36.37,90.79 35.73,90.16 35.73,88.86 36.04,88.56 ; 36.04,88.56 36.37,88.89 38.58,88.89 U8.1 41.76,91.19 44.37,91.19 ; 36.04,88.56 22.27,74.79 18.72,74.79 17.57,73.65 17.57,72.76 18.97,71.36 20.86,71.36 C7.1 20.7,71.1 18.85,69.25 ; NOREF#10.10 57.22,10.91 C4.1 66.41,18.7 U4.1 85.23,33.64 92.12,33.64 93.52,35.04 93.52,40.12 94.28,40.88 95.17,40.88 96.69,42.41 96.69,45.14 94,47.84 ; NOREF#10.10 54.4,10.78 49.07,10.78 43.35,16.5 35.1,16.5 19.39,32.21 19.39,39.65 19.02,40.02 U6.1 19.33,40.44 C6.1 ; NOREF#10.10 46.27,19.17 U5.1 38.12,21.56 C5.1 ; 94,47.84 96.57,50.41 96.57,68.19 94.66,70.09 94.66,73.27 91.69,76.24 88.06,76.24 ; 90.49,66.54 91.44,67.49 U2.1 88.77,72 88.44,72 88.06,72.38 88.06,76.24
1: length 129.2
  Top Layer w0.37: NOREF#4.4 60.37,2.15 61.77,3.54 61.77,9.13 62.4,9.77 66.47,9.77 68.75,12.05 68.75,13.55 70.56,15.36 75.36,15.36 77.26,17.26 77.26,18.53 94.15,35.42 94.15,38.85 96.95,41.64 96.95,43.68 95.93,44.69 95.93,68.82 94.41,70.35 94.41,73.39 77.26,90.54 75.87,90.54 72.6,93.81 68.33,93.81 SW1.2
2: length 18.9
  Top Layer w0.37: 42.54,15.49 50.46,15.49 52.75,13.2 NOREF#9.6
3: length 96.7
  Top Layer w0.37: 91.86,74.13 93.14,72.85 93.14,69.97 94.92,68.19 94.92,44.31 96.06,43.17 96.06,42.41 93.14,39.49 93.14,35.8 76.25,18.91 76.25,17.39 75.1,16.24 70.53,16.24 67.86,13.58 67.86,12.56 65.96,10.66 61.64,10.66 60.75,9.77 60.75,4.81 59.48,3.54 57.45,3.54 NOREF.3
4: length 48.8
  Top Layer w0.37: NOREF#3.5 49.2,13.07 48.18,14.09 42.46,14.09 40.81,15.74 40.81,16.88 39.67,18.02 35.91,18.02 SW6.2
5: length 57.2
  Top Layer w0.37: NOREF#7.8 59.48,5.46 59.48,10.91 60.12,11.55 64.69,11.55 70.15,17.01 74.85,17.01 75.36,17.51 75.36,19.29 91.99,35.93 91.99,39.94 SW3.2
6: length 86.4
  Top Layer w0.37: SW7.2 15.42,42.15 16.94,40.63 16.94,35.42 35.1,17.26 39.16,17.26 39.92,16.5 39.92,15.36 42.34,12.94 45.77,12.94 47.8,10.91 47.8,5.07 48.81,4.05 50.85,4.05 NOREF#12.2
7: length 28.1
  Top Layer w0.37: SW4.2 72.66,19.8 70.4,19.8 68.88,18.28 68.88,16.88 66.98,14.97 63.67,14.97 61.9,13.2 59.36,13.2 56.05,9.89 NOREF#6.7
8: length 118.1
  Top Layer w0.37: SW8.2 30.69,86.6 27.22,86.6 17.19,76.57 17.19,73.27 14.4,70.47 14.4,41.9 15.79,40.5 15.79,35.04 34.46,16.37 37.77,16.37 42.46,11.67 44.5,11.67 46.66,9.51 46.66,4.69 NOREF#13.1
DIN: length 20.6
  Bottom Layer w0.37: NOREF#5.12 68.25,12.11 68.25,14.97 70.15,16.88 74.72,16.88 75.61,17.77 75.61,19.6 U4.4
DOUT: length 14.1
  Bottom Layer w0.37: U5.2 42.45,21.45 46.27,21.45 47.54,20.18 49.58,20.18 50.08,19.67 53.64,19.67 NOREF#14.11
$1N1699: length 38.1
  Bottom Layer w0.37: U1.2 69.29,88 65.31,88 63.4,89.9 49.2,89.9 44.62,94.48 41.44,94.48 36.85,89.88
$1N1729: length 37.2
  Bottom Layer w0.37: 88.46,68.16 88.46,69.06 85.26,72.25 85.26,81.14 74.33,92.08 U1.4
$1N1734: length 37.8
  Bottom Layer w0.37: 89.69,73.8 94.41,69.08 94.41,51.41 88.57,45.57 88.57,41.5 87.79,40.72
$1N1800: length 37.3
  Bottom Layer w0.37: U4.2 69.74,21.67 72.94,24.88 74.09,24.88 84.25,35.04 91.61,35.04 91.99,35.42 91.99,43.19 U3.4
$1N1842: length 35.6
  Bottom Layer w0.37: U6.4 20.77,42.03 21.78,43.03 21.78,44.3 18.33,47.74 18.33,64.52 21.78,67.97
$1N1852: length 38.8
  Bottom Layer w0.37: U6.2 21.99,31.25 35.73,17.51 44.64,17.51 U5.4
$1N6884: length 38.1
  Bottom Layer w0.37: U7.4 17.03,64.85 21.51,69.33 22.91,69.33 23.92,70.35 23.92,74.66 37.38,88.13 40.31,88.13 41.07,88.89 42.25,88.89 U8.2

## Text on the board
Bottom Silkscreen Layer: VCC | GND | DOUT | DIN | https://MPAM-Lab.xyz
Top Silkscreen Layer: 6 | 8 | 5 | 7 | 4 | 2 | 3 | 1 | TM | GND | @nonefffds | FDS | Circuller | Rev 0.3f | MPAM / Laboratory

# Board PCB6
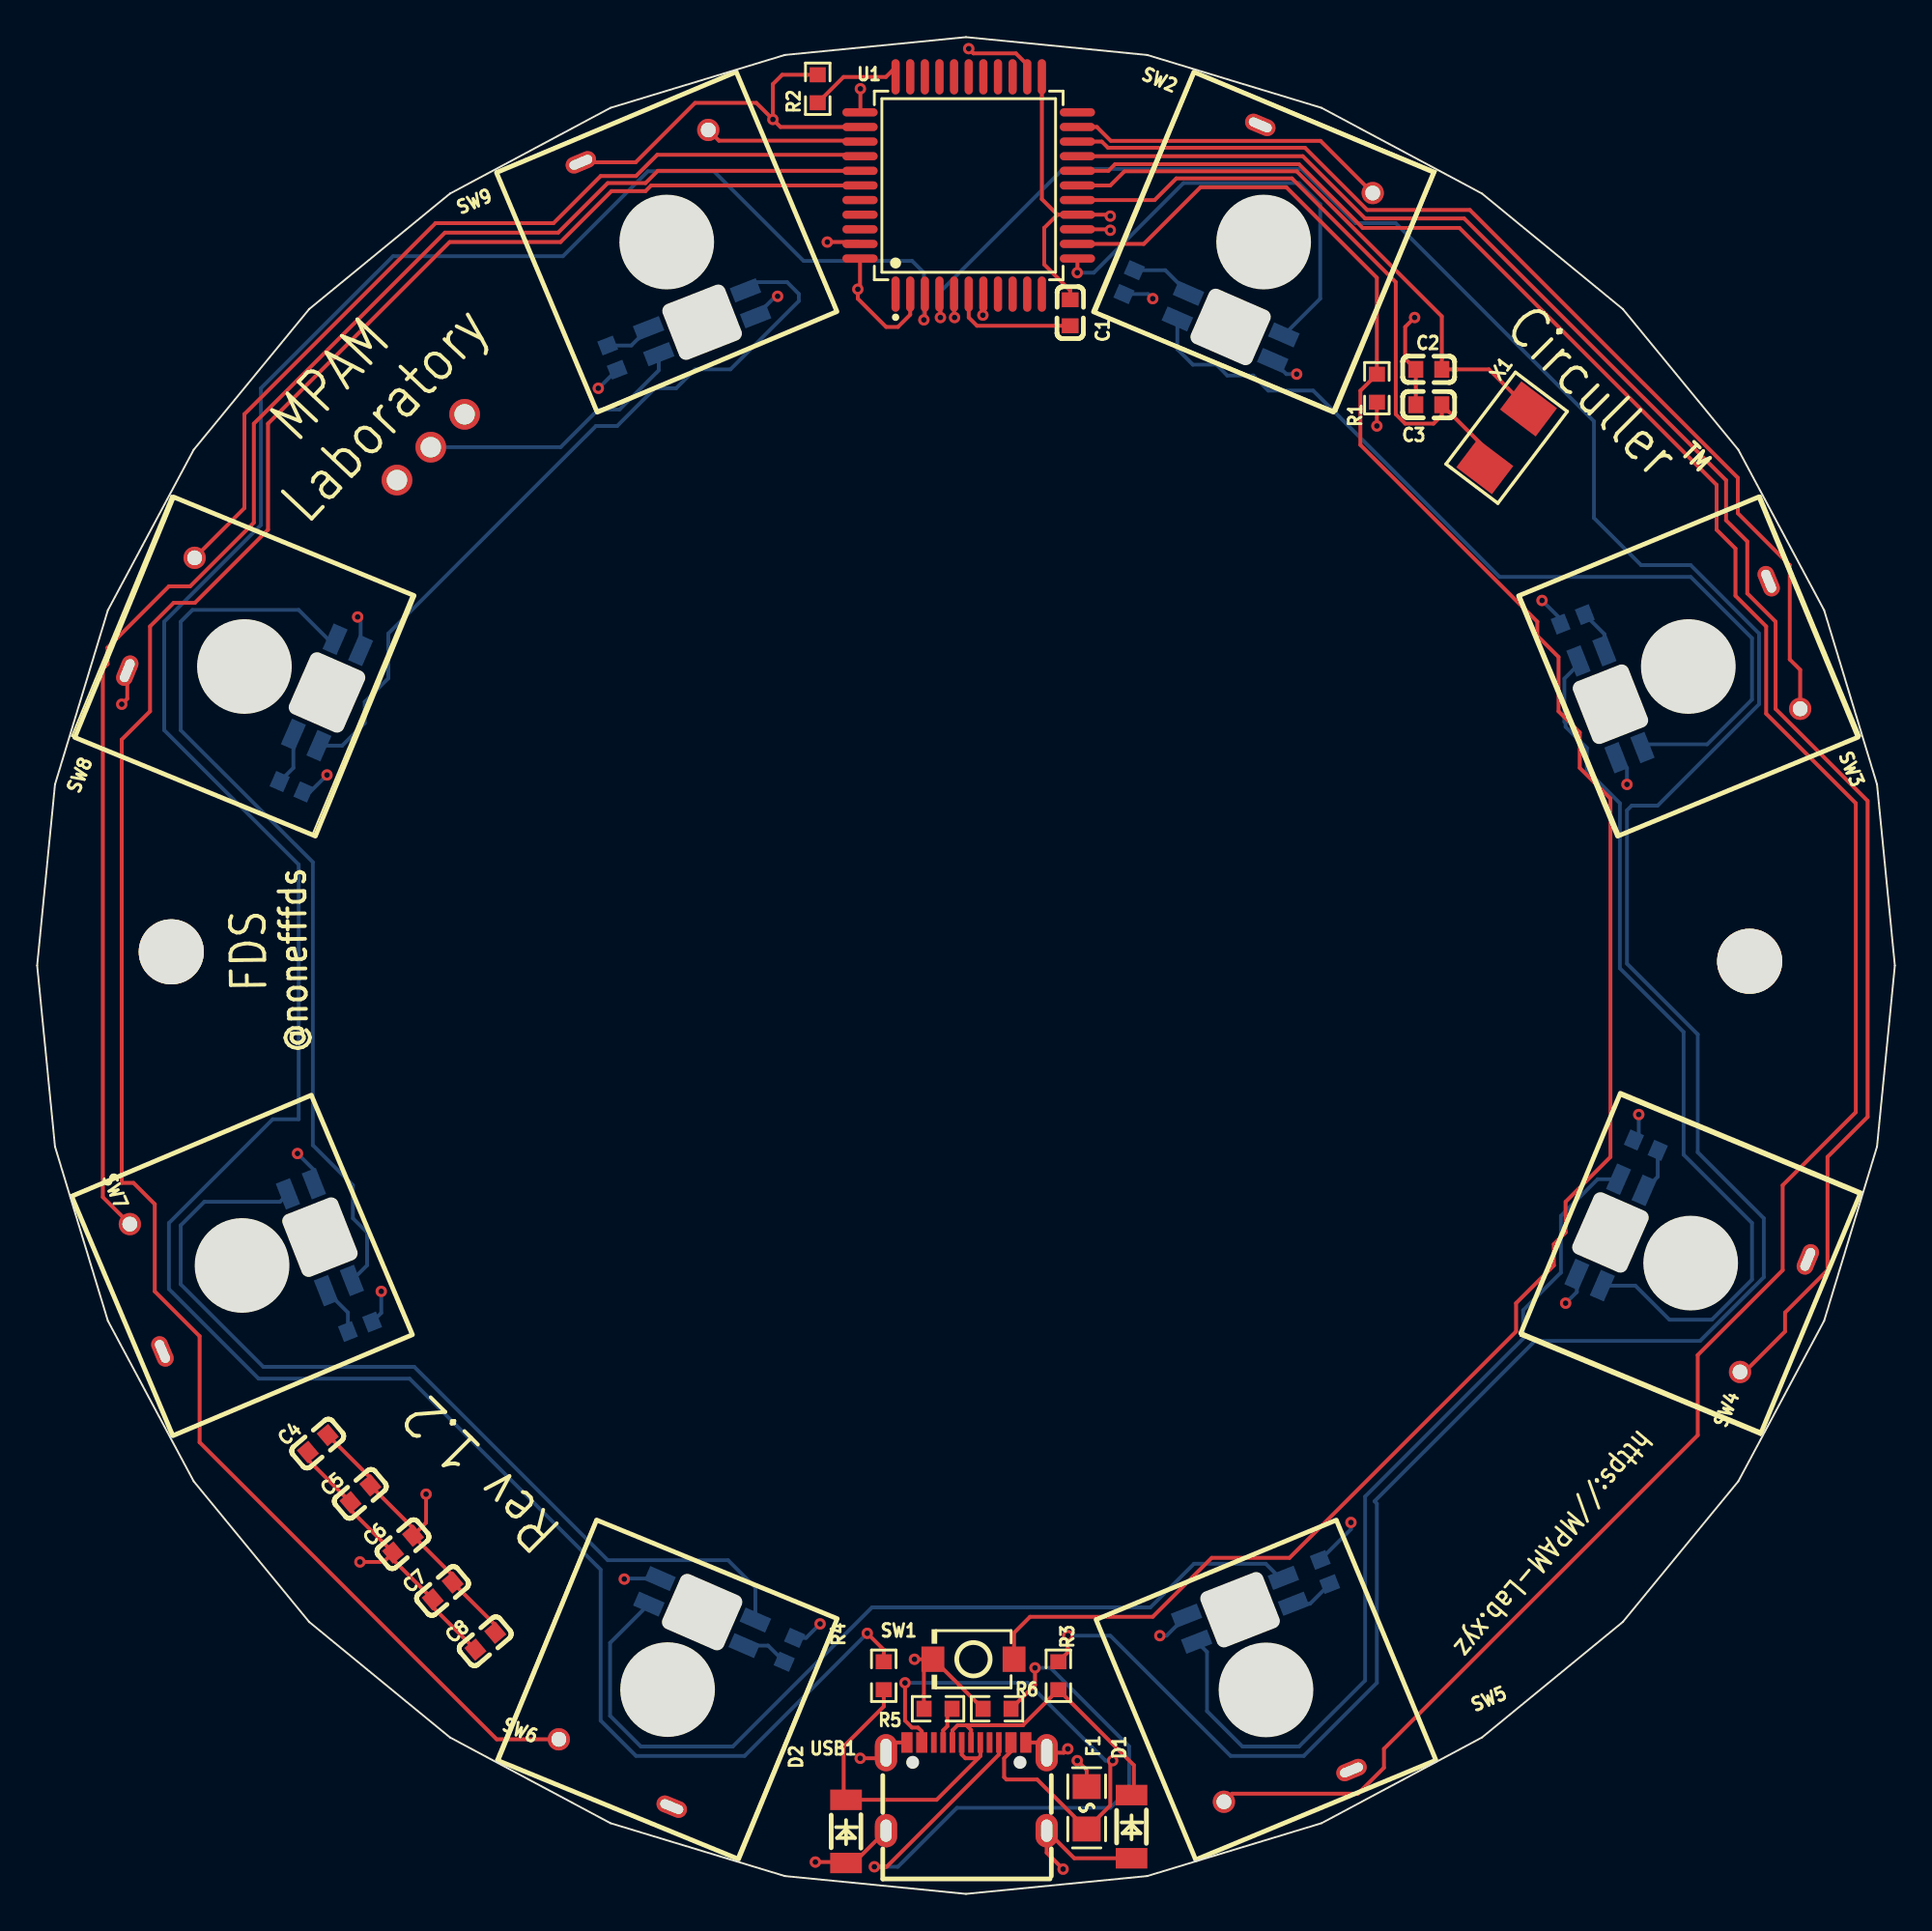
[diagram p4: board, top side]
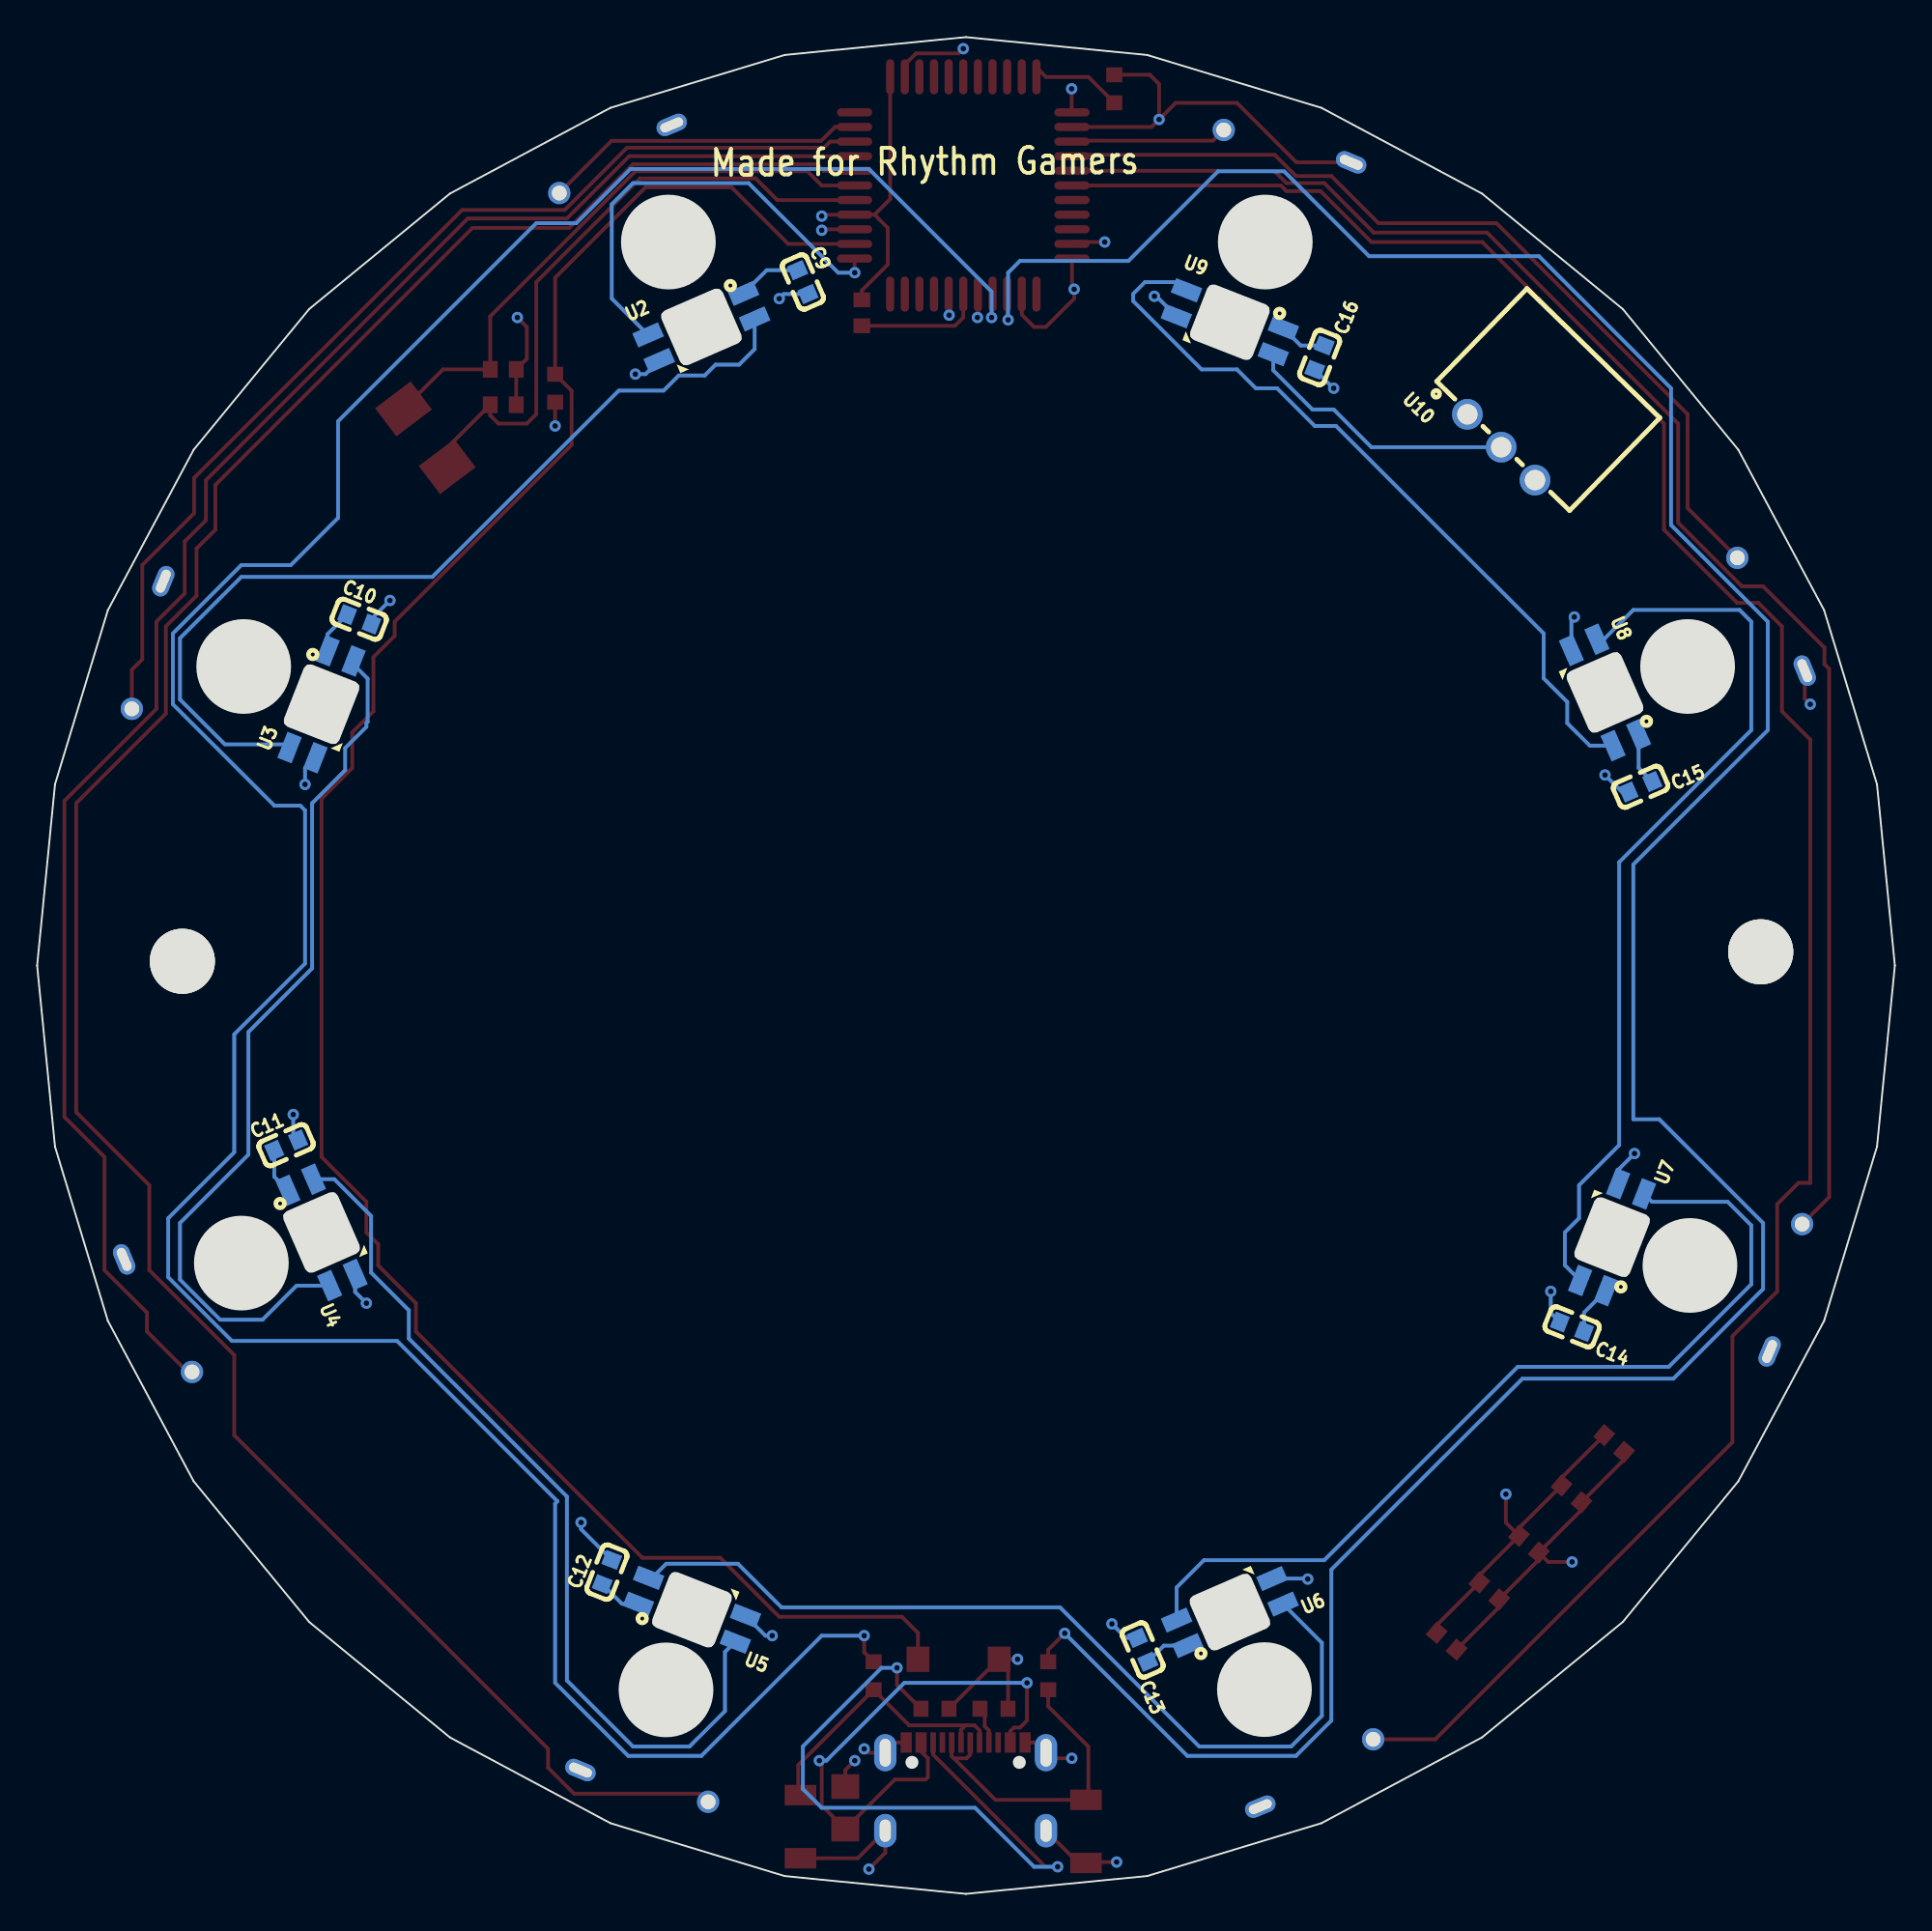
[diagram p5: board, bottom side, seen from below]

Outline 100 x 100 mm; copper layers: Top Layer, GND, VCC, Bottom Layer. Coordinates in mm from the lower left corner of the outline.
Outline path: 0,50 0.96,40.24 3.81,30.87 8.43,22.22 14.64,14.64 22.22,8.43 30.87,3.81 40.25,0.96 50,0 59.75,0.96 69.13,3.81 77.78,8.43 85.36,14.64 91.57,22.22 96.19,30.87 99.04,40.24 100,50 99.04,59.75 96.19,69.13 91.57,77.78 85.36,85.35 77.78,91.57 69.13,96.19 59.75,99.04 50,100 40.25,99.04 30.87,96.19 22.22,91.57 14.64,85.35 8.43,77.78 3.81,69.13 0.96,59.75 0,50
Stack: Top Layer 0.035mm 外层铜厚1oz / Dielectric1 0.28mm 7628 RC49% 8.6mil / GND 0.035mm - / Dielectric2 0.28mm 1.1mm H/HOZ 含铜 / VCC 0.035mm - / Dielectric3 0.28mm 7628 RC49% 8.6mil / Bottom Layer 0.035mm 外层铜厚1oz

## Design rules (mm)
template: JLCPCB Capability(Two Layers Board)
spacing copperThickness1oz (default): track to track 0.102, other pairs 0.152 to 0.3
spacing copperThickness2oz: track to track 0.203, other pairs 0.152 to 0.3
track width copperThickness1oz (default): min 0.127, default 0.254, max 2.54
track width copperThickness2oz: min 0.203, default 0.254, max 2.54
differential pair differentialPair (default): width min 0.127, default 0.254, max 2.54; gap min 0.152, default 0.152
via viaSize (default): diameter min 0.5, default 0.61, max 10; hole min 0.3, default 0.305, max 6.3

## Placement (name value [footprint] x y rotation side)
C1  1uF  [C0603]  55.61 85.15 270 top
C2  22pF  [C0603]  74.91 82.11 0 top
C3  22pF  [C0603]  74.91 80.2 0 top
C4  100nF  [C0603]  15.11 24.25 40.3 top
C5  100nF  [C0603]  17.4 21.55 40.3 top
C6  100nF  [C0603]  19.7 18.84 40.3 top
C7  100nF  [C0603]  21.83 16.32 40.3 top
C8  470nF  [C0603]  24.12 13.61 40.3 top
C9  100nF  [C0603]  58.78 86.8 246.5 bottom
C10  100nF  [C0603]  82.66 68.64 201.5 bottom
C11  100nF  [C0603]  86.6 40.32 156.4 bottom
C12  100nF  [C0603]  69.32 17.34 111.4 bottom
C13  100nF  [C0603]  40.49 13.14 66.5 bottom
C14  100nF  [C0603]  17.38 30.54 21.5 bottom
C15  100nF  [C0603]  13.7 59.63 336.4 bottom
C16  100nF  [C0603]  30.97 82.74 291.4 bottom
D1  ZMM3V6  [LL-34_L3.5-W1.5-RD]  58.91 3.62 270 top
D2  ZMM3V6  [LL-34_L3.5-W1.5-RD]  43.54 3.37 270 top
F1  2.5A/32VFUSESMD0805  [F0805]  56.5 4.64 270 top
NOREF  -  [Pad_e405]  7.22 50.74 0 top
NOREF#2  -  [Pad_e406]  92.18 50.23 0 top
R1  10kΩ  [R0603]  72.12 81.09 90 top
R2  10kΩ  [R0603]  42.02 97.22 90 top
R3  22Ω  [R0603]  54.97 11.75 270 top
R4  22Ω  [R0603]  45.57 11.75 270 top
R5  5.1kΩ  [R0603]  48.5 9.97 0 top
R6  5.1kΩ  [R0603]  51.67 9.97 0 top
SW1  TS-1088-AR02016  [SW-SMD_L3.9-W3.0-P4.45]  50.4 12.64 180 top
SW2  佳达隆矮轴_焊接  [佳达隆矮轴焊接]  66.02 88.96 337.3 top
SW3  佳达隆矮轴_焊接  [佳达隆矮轴焊接]  88.88 66.1 292.4 top
SW4  佳达隆矮轴_焊接  [佳达隆矮轴焊接]  89.01 33.97 247.5 top
SW5  佳达隆矮轴_焊接  [佳达隆矮轴焊接]  66.15 10.99 202.5 top
SW6  佳达隆矮轴_焊接  [佳达隆矮轴焊接]  33.94 11 157.7 top
SW7  佳达隆矮轴_焊接  [佳达隆矮轴焊接]  11.03 33.85 112.9 top
SW8  佳达隆矮轴_焊接  [佳达隆矮轴焊接]  11.16 66.1 67.7 top
SW9  佳达隆矮轴_焊接  [佳达隆矮轴焊接]  33.89 88.96 22.8 top
U1  ATMEGA32U4-AU  [QFP-44_L10.0-W10.0-P0.80-LS13.2-BL]  50.15 92.01 0 top
U2  WS2812B-3528幻彩反贴  [LED-SMD_L3.2-W2.8-TR]  64.24 84.39 156.5 bottom
U3  WS2812B-3528幻彩反贴  [LED-SMD_L3.2-W2.8-TR]  84.69 64.07 111.5 bottom
U4  WS2812B-3528幻彩反贴  [LED-SMD_L3.2-W2.8-TR]  84.69 35.62 66.4 bottom
U5  WS2812B-3528幻彩反贴  [LED-SMD_L3.2-W2.8-TR]  64.75 15.3 21.4 bottom
U6  WS2812B-3528幻彩反贴  [LED-SMD_L3.2-W2.8-TR]  35.8 15.18 336.5 bottom
U7  WS2812B-3528幻彩反贴  [LED-SMD_L3.2-W2.8-TR]  15.22 35.37 291.5 bottom
U8  WS2812B-3528幻彩反贴  [LED-SMD_L3.2-W2.8-TR]  15.6 64.71 246.4 bottom
U9  WS2812B-3528幻彩反贴  [LED-SMD_L3.2-W2.8-TR]  35.8 84.65 201.4 bottom
U10  XH2.54-WI-3P  [CONN-TH_XH2.54-WI-3P]  21.19 77.91 224.2 bottom
USB1  TYPE-C 16PIN 2MD(073)  [USB-C-SMD_TYPE-C-6PIN-2MD-073]  50.02 5.78 0 top
X1  -  [OSC-SMD_2P-L5.0-W3.2]  79.1 78.42 52.9 top

## Footprints (pads in the part's own frame, mm; a bottom-side part is the same pattern mirrored in y, then rotated)
C0603
  rect 0.8x0.9 smd: 1(-0.7,0) 2(0.7,0)
CONN-TH_XH2.54-WI-3P
  round 1.65 hole 1.1: 1(-2.54,0) 2(0,0) 3(2.54,0)
F0805
  rect 1.335x1.5 smd: 1(-1.143,0) 2(1.143,0)
LED-SMD_L3.2-W2.8-TR
  rect 1.5x0.82 smd: 1(2.8,0.75) 2(2.8,-0.75) 3(-2.8,-0.75) 4(-2.8,0.75)
LL-34_L3.5-W1.5-RD
  rect 1.1x1.7 smd: 1(-1.7,0) 2(1.7,0)
OSC-SMD_2P-L5.0-W3.2
  rect 1.9x2.4 smd: 1(-1.95,0) 2(1.95,0)
Pad_e405
  round 3.5 hole 3.5: 13(0,0)
Pad_e406
  round 3.5 hole 3.5: 14(0,0)
QFP-44_L10.0-W10.0-P0.80-LS13.2-BL
  oval 0.441x1.895 smd: 1(-3.937,-5.851) 2(-3.15,-5.851) 3(-2.362,-5.851) 4(-1.575,-5.851) 5(-0.787,-5.851) 6(0,-5.851) 7(0.787,-5.851) 8(1.575,-5.851) 9(2.362,-5.851) 10(3.15,-5.851) 11(3.937,-5.851) 23(3.937,5.851) 24(3.15,5.851) 25(2.362,5.851) 26(1.575,5.851) 27(0.787,5.851) 28(0,5.851) 29(-0.787,5.851) 30(-1.575,5.851) 31(-2.362,5.851) 32(-3.15,5.851) 33(-3.937,5.851)
  oval 1.895x0.441 smd: 12(5.851,-3.937) 13(5.851,-3.15) 14(5.851,-2.362) 15(5.851,-1.575) 16(5.851,-0.787) 17(5.851,0) 18(5.851,0.787) 19(5.851,1.575) 20(5.851,2.362) 21(5.851,3.15) 22(5.851,3.937) 34(-5.851,3.937) 35(-5.851,3.15) 36(-5.851,2.362) 37(-5.851,1.575) 38(-5.851,0.787) 39(-5.851,0) 40(-5.851,-0.787) 41(-5.851,-1.575) 42(-5.851,-2.362) 43(-5.851,-3.15) 44(-5.851,-3.937)
R0603
  rect 0.806x0.864 smd: 1(-0.753,0) 2(0.753,0)
SW-SMD_L3.9-W3.0-P4.45
  rect 1.23x1.36 smd: 1(-2.185,0) 2(2.185,0)
USB-C-SMD_TYPE-C-6PIN-2MD-073
  rect 0.6x1.1 smd: 1(-3.2,2.375) 2(-2.4,2.375) 11(2.4,2.375) 12(3.2,2.375)
  rect 0.3x1.1 smd: 3(-1.75,2.375) 4(-1.25,2.375) 5(-0.75,2.375) 6(-0.25,2.375) 7(0.25,2.375) 8(0.75,2.375) 9(1.25,2.375) 10(1.75,2.375)
  oval 1.2x2 hole 0.6x1.5: 13(-4.325,1.825) 14(4.325,1.825)
  oval 1.2x1.8 hole 0.6x1.2: 13(-4.325,-2.375) 14(4.325,-2.375)
佳达隆矮轴焊接
  oval 1.7x0.9 hole 1.3x0.5: 1(-2.6,5.75)
  round 1.2 hole 0.8: 2(4.4,4.7)

## Nets
As in the schematic.

Pads without a net: NOREF 13; NOREF#2 14; U1 1 8 9 10 11 22 25 26 27 28 29 30 31 32 40 41 42; USB1 3 9

## Via types
v1: diameter 0.61, hole 0.305, Top Layer to Bottom Layer, 45 vias

## Routing (per net, layer and track width the routed paths; a pad name or vN(x,y) marks a point on that pad's centre or on a via; arc(x,y) is an arc through that point)
GND: length 103.7
  Top Layer w0.203: v1(39.61,95.57) 39.61,97.47 40.1,97.97 R2.2 ; v1(39.61,95.57) 38.72,96.46 35.41,96.46 32.22,93.26 SW9.1 ; v1(39.61,95.57) 40.01,95.16 U1.35 ; USB1.12 53.79,8.15 USB1.14 55.27,7.6 v1(55.48,7.81) ; U1.5 49.36,84.92 v1(49.38,84.9) ; SW1.2 47.73,12.15 47.73,9.98 R5.1 ; SW1.2 v1(47.23,12.64) ; SW1.2 48.25,12.64 R6.1 ; D1.2 55.83,1.92 USB1.14 54.34,2.22 v1(55.23,1.33) ; v1(4.55,64.07) 4.85,64.37 SW8.1 ; 54.92,90.44 54.08,91.27 U1.23 ; 54.92,90.44 U1.15 57.69,90.44 v1(57.77,90.36) ; 54.92,90.44 54.21,89.73 54.21,87.75 55.61,86.35 C1.1 ; C3.1 C2.1 73.64,82.68 73.64,84.39 v1(74.15,84.9) ; C6.1 18.66,17.88 v1(17.37,17.88) ; C6.1 16.87,20.68 C5.1 14.57,23.39 C4.1 ; C6.1 19.16,18 21.3,15.86 21.3,15.45 C8.1 ; v1(44.3,7.3) 45.39,7.3 46.24,8.15 USB1.1 ; U1.43 44.19,88.96 v1(42.53,88.96) ; v1(41.89,1.71) 43.49,1.71 D2.2 43.96,1.67 45.69,3.4
  Bottom Layer w0.203: v1(39.86,86.04) 39.75,86.04 38.68,84.97 ; 33.53,16.98 31.63,16.98 v1(31.6,16.95) ; U2.3 67.24,81.85 v1(67.8,81.85) ; U8.3 17.41,68.61 v1(17.25,68.77) ; v1(85.58,59.75) 85.58,60.63 U3.3 ; 61.87,14.98 60.8,13.91 v1(60.43,13.91) ; v1(82.28,31.81) 82.88,32.42 U4.3 ; U7.3 14.9,38.99 v1(14.01,39.87)
VCC: length 49.6
  Top Layer w0.203: C6.2 20.94,19.99 v1(20.94,21.53) ; C6.2 20.23,19.7 C5.2 17.94,22.41 15.64,24.71 ; C6.2 22.37,17.16 C7.2 24.66,14.48 24.66,14.06 ; v1(50.91,85.03) 50.93,85.05 50.93,86.54 ; 53.3,97.99 53.3,98.51 52.69,99.12 50.4,99.12 v1(50.15,99.38) ; F1.1 56.5,6.67 v1(55.99,7.18) ; U1.34 44.31,95.97 v1(44.31,97.22) ; U1.44 44.29,86.54 v1(44.18,86.42) 44.18,85.92 45.7,84.39 46.34,84.39 47,85.05 U1.2 ; v1(57.77,89.6) 57.72,89.65 U1.14 ; R1.1 v1(72.12,79.06)
  Bottom Layer w0.203: v1(15.6,60.26) 14.69,59.35 C15.2 ; v1(18.52,32.45) 18.52,31.29 C14.2 ; v1(60.05,85.92) 59.8,86.16 C9.2 ; C10.2 82.01,68.66 v1(81.01,69.66) ; C11.2 86.21,40.86 v1(86.21,41.97) ; 69.07,17.99 70.72,19.64 v1(70.72,20) ; v1(42.14,14.54) 41.39,13.79 40.77,13.79 ; v1(30.21,81.09) 30.23,81.09 31.22,82.09
1: length 8.4
  Top Layer w0.203: U1.36 44.24,94.42 36.7,94.42 36.13,95
2: length 133.8
  Top Layer w0.203: SW5.2 64.32,5.4 71.1,5.4 72.5,6.79 72.5,7.81 89.39,24.7 89.39,29.02 93.96,33.59 93.96,38.16 97.9,42.1 97.9,58.74 93.07,63.56 93.07,68.26 91.42,69.91 91.42,72.45 90.41,73.47 90.41,75.88 76.56,89.73 71.36,89.73 67.93,93.15 58.02,93.15 57.66,92.8 U1.18
3: length 17.4
  Top Layer w0.203: U1.21 57.05,95.16 57.79,94.41 69.08,94.41 SW2.2
4: length 124
  Top Layer w0.203: SW6.2 24.74,8.32 8.74,24.32 8.74,30.04 6.33,32.45 6.33,37.15 5.19,38.29 4.55,38.29 4.55,62.17 6.08,63.69 6.08,68.26 7.35,69.53 8.49,69.53 12.43,73.47 12.43,79.18 22.21,88.96 28.18,88.96 30.92,91.71 32.75,91.71 33.05,92.01 U1.39
5: length 56.9
  Top Layer w0.203: SW3.2 94.9,65.92 94.34,66.48 94.34,71.56 91.55,74.36 91.55,76.26 77.12,90.69 71.6,90.69 68.24,94.04 57.64,94.04 57.31,94.37 U1.20
6: length 86
  Top Layer w0.203: SW7.2 3.54,37.52 3.54,65.98 3.79,66.23 3.79,67.12 7.09,70.42 8.24,70.42 11.67,73.85 11.67,79.18 21.95,89.47 28.05,89.47 30.72,92.14 32.75,92.14 33.41,92.8 U1.38
7: length 96.3
  Top Layer w0.203: SW4.2 91.91,28.11 94.09,30.29 94.09,31.31 96.37,33.59 96.37,39.69 98.53,41.85 98.53,58.86 93.58,63.82 93.58,68.52 92.06,70.04 92.06,72.83 90.91,73.98 90.91,76.14 76.82,90.23 71.48,90.23 68.13,93.59 U1.19
8: length 47.8
  Top Layer w0.203: SW8.2 11.16,74.64 11.16,79.69 21.44,89.98 27.79,89.98 30.33,92.52 32.24,92.52 33.38,93.66 44.22,93.66 U1.37
D+: length 161.5
  Top Layer w0.203: U1.3 47.78,84.82 v1(47.73,84.77) ; v1(44.69,14.03) 45.57,13.14 R4.1
  Bottom Layer w0.203: v1(47.73,84.77) 47.73,87.31 47.1,87.95 41.26,87.95 36.43,92.77 32.87,92.77 28.3,88.2 19.16,88.2 12.05,81.09 12.05,73.72 6.84,68.52 6.84,62.67 14.08,55.44 14.08,41.72 12.68,41.72 7.09,36.13 7.09,32.58 11.92,27.75 20.05,27.75 30.33,17.46 30.33,9.33 32.24,7.43 38.08,7.43 v1(44.69,14.03)
D-: length 162.7
  Top Layer w0.203: v1(55.48,13.91) 55.48,13.01 R3.1 ; U1.4 48.62,86.11 v1(48.62,84.9)
  Bottom Layer w0.203: v1(48.62,84.9) 48.62,86.3 55.23,92.9 68.05,92.9 70.97,89.98 73.13,89.98 83.8,79.31 83.8,74.1 86.34,71.56 89.01,71.56 92.69,67.88 92.69,64.07 87.23,58.61 85.83,58.61 85.58,58.36 85.58,50.1 89.39,46.29 89.39,39.94 92.95,36.39 92.95,33.21 89.52,29.78 80.63,29.78 71.99,21.15 72.12,21.02 72.12,11.37 68.18,7.43 64.24,7.43 57.77,13.91 v1(55.48,13.91)
DOUT: length 14.9
  Bottom Layer w0.203: U10.2 28.18,77.91 30.21,79.95 31.35,79.95 33.46,82.06 33.46,82.93
LED: length 24.2
  Top Layer w0.203: U1.12 56,87.32 v1(55.99,87.31)
  Bottom Layer w0.203: v1(55.99,87.31) 56.88,87.31 61.7,92.14 67.93,92.14 69.07,91 69.07,85.92 67.11,83.96
$1N992: length 31.6
  Top Layer w0.203: 80.28,79.98 78.15,82.11 C2.2 75.61,84.96 67.8,92.77 58.53,92.77 57.77,92.01 U1.17
$1N1040: length 34.8
  Top Layer w0.203: X1.1 77.93,77.89 C3.2 75.61,79.63 75.17,79.18 73.64,79.18 73.13,79.69 73.13,86.8 67.55,92.39 61.32,92.39 60.15,91.22 U1.16
$1N1214: length 119.4
  Top Layer w0.203: SW1.1 52.58,14.06 53.45,14.92 60.05,14.92 63.23,18.1 67.42,18.1 79.61,30.29 79.61,31.81 81.64,33.85 81.64,34.99 82.28,35.62 82.28,37.27 84.69,39.69 84.69,58.99 83.04,60.64 83.04,62.55 81.9,63.69 81.9,66.61 80.75,67.75 80.75,68.52 71.23,78.04 71.23,80.95 R1.2 72.12,87.04 67.24,91.91 62.62,91.91 59.57,88.86 U1.13
$1N1318: length 4.9
  Top Layer w0.203: R2.1 43.41,97.85 45.69,97.85 46.08,98.24 46.21,98.24
$1N2823: length 28.6
  Top Layer w0.203: v1(57.89,7.18) 57.77,7.05 57.77,4.76 F1.2 53.83,6.16 52.18,6.16 52.05,6.29 52.05,7.3 52.42,7.67 USB1.11 ; v1(46.72,11.37) 46.72,9.33 47.09,8.96 47.42,8.96 47.62,8.75 USB1.2
  Bottom Layer w0.203: v1(46.72,11.37) 53.32,11.37 57.51,7.18 v1(57.89,7.18)
$1N3423: length 15.1
  Top Layer w0.203: 50.02,9.08 49.54,9.08 49.27,8.81 USB1.5 ; 50.02,9.08 50.27,8.83 50.27,8.16 USB1.7 ; 50.02,9.08 53.07,9.08 53.07,9.09 R3.2 59.04,6.93 59.04,5.91
$1N3438: length 17.4
  Top Layer w0.203: USB1.6 49.77,7.5 49.97,7.3 50.65,7.3 ; R4.2 45.57,10.1 43.42,7.94 43.42,5.19 D2.1 48.42,5.07 50.65,7.3 ; 50.65,7.3 50.78,7.43 50.78,8.14 USB1.8
$1N3472: length 2
  Top Layer w0.203: USB1.4 48.77,8.81 48.99,9.03 48.99,9.72 R5.2
$1N3479: length 37
  Top Layer w0.203: v1(53.71,12.17) 53.71,11.26 R6.2 ; 45.19,1.46 45.73,1.46 51.77,7.5 USB1.10
  Bottom Layer w0.203: v1(45.07,1.46) 46.34,1.46 49.51,4.64 57.77,4.64 58.78,5.65 58.78,7.94 54.55,12.17 v1(53.71,12.17)
$1N3933: length 49.3
  Bottom Layer w0.203: U3.4 86.58,61.91 89.9,61.91 92.31,64.33 92.31,67.63 89.01,70.93 78.72,70.93 68.69,80.96 66.28,80.96 65.46,81.78 64.07,81.78 63.48,82.36 62.21,82.36 61.38,83.19 61.38,84.82
$1N3938: length 47.5
  Bottom Layer w0.203: U3.2 82.97,66.21 82.21,65.45 82.21,63.12 82.28,63.06 82.28,62.85 83.42,61.71 83.42,60.52 85.2,58.74 85.2,49.85 88.63,46.42 88.63,39.81 92.31,36.13 92.31,33.08 90.15,30.92 87.86,30.92 86.03,32.76 U4.4
$1N3943: length 48
  Bottom Layer w0.203: U5.4 62.97,13.03 62.97,9.84 64.88,7.94 67.93,7.94 71.48,11.49 71.48,21.4 79.99,29.91 79.99,31.43 82.02,33.46 82.02,36.51 84,38.49 U4.2
$1N3948: length 48.2
  Bottom Layer w0.203: U5.2 66.89,17.02 66.14,17.78 62.27,17.78 59.92,15.43 44.94,15.43 37.45,7.94 32.49,7.94 30.84,9.59 30.84,13.52 U6.4
$1N3953: length 49.1
  Bottom Layer w0.203: U6.2 38.66,16.5 37.19,17.97 30.72,17.97 20.3,28.38 12.17,28.38 7.73,32.83 7.73,36 9,37.27 13.07,37.27 U7.4
$1N3959: length 49.2
  Bottom Layer w0.203: U7.2 17.76,33.86 17.76,35.62 17,36.39 17,38.16 14.84,40.32 14.84,55.56 7.73,62.67 7.73,68.52 8.36,69.15 14.08,69.15 15.66,67.57 U8.4
$1N3965: length 41.5
  Bottom Layer w0.203: 38.13,86.36 38.57,86.8 40.37,86.8 41,86.17 41,85.79 37.32,82.11 35.41,82.11 34.4,81.09 33.26,81.09 31.22,79.06 30.08,79.06 18.9,67.88 18.9,65.47 17.63,64.2 17.63,63.06 16.42,61.84 15.17,61.84
$1N4279: length 3.4
  Bottom Layer w0.203: 59.06,87.45 60.73,87.45 U2.1
$1N4296: length 2.4
  Bottom Layer w0.203: 84.36,66.95 84.36,67.84 C10.1
$1N4306: length 2.5
  Bottom Layer w0.203: U4.1 87.24,38.63 C11.1
$1N4316: length 2.4
  Bottom Layer w0.203: 67.63,15.63 68.52,15.63 69.58,16.68
$1N4320: length 2.5
  Bottom Layer w0.203: U6.1 39.35,13.37 C13.1
$1N4353: length 2.6
  Bottom Layer w0.203: 32.91,84.32 31.98,83.39 C16.1
$1N4416: length 2.7
  Bottom Layer w0.203: U7.1 16.73,31.31 C14.1
$1N4551: length 2.8
  Bottom Layer w0.203: U8.1 13.79,60.64 C15.1
$1N4867: length 6.8
  Top Layer w0.203: C1.2 50.59,84.45 50.15,84.9 50.15,86.03

## Copper pours and planes (outline as drawn; the poured copper is in the pictures)
GND on GND: 22.13,80.59 23.14,80.59 23.14,79.56 22.13,79.56
GND on GND: 22.88,79.81 23.9,79.81 23.9,78.78 22.88,78.78
GND on GND: 22.88,80.57 23.92,80.57 23.92,79.56 22.88,79.56
GND on GND: 22.1,79.81 23.14,79.81 23.14,78.8 22.1,78.8
GND on GND: 0.26,99.71 99.74,99.71 99.74,0.26 0.26,0.26
VCC on VCC: 18.46,76.27 19.5,76.27 19.5,75.26 18.46,75.26
VCC on VCC: 0.26,99.74 99.74,99.74 99.74,0.26 0.26,0.26
VCC on VCC: 18.48,77.05 19.5,77.05 19.5,76.01 18.48,76.01
VCC on VCC: 19.24,77.03 20.28,77.03 20.28,76.01 19.24,76.01
VCC on VCC: 19.24,76.27 20.25,76.27 20.25,75.24 19.24,75.24

Small or netless copper shapes (teardrops, artwork), in the pictures only: 48 on GND

## Text on the board
Bottom Silkscreen Layer: Made for Rhythm Gamers
Top Silkscreen Layer: TM | https://MPAM-Lab.xyz | @nonefffds | FDS | Circuller | Rev 1.2 | MPAM / Laboratory
